# EAGLE board main (EAGLE 6.1), part 1 of 2
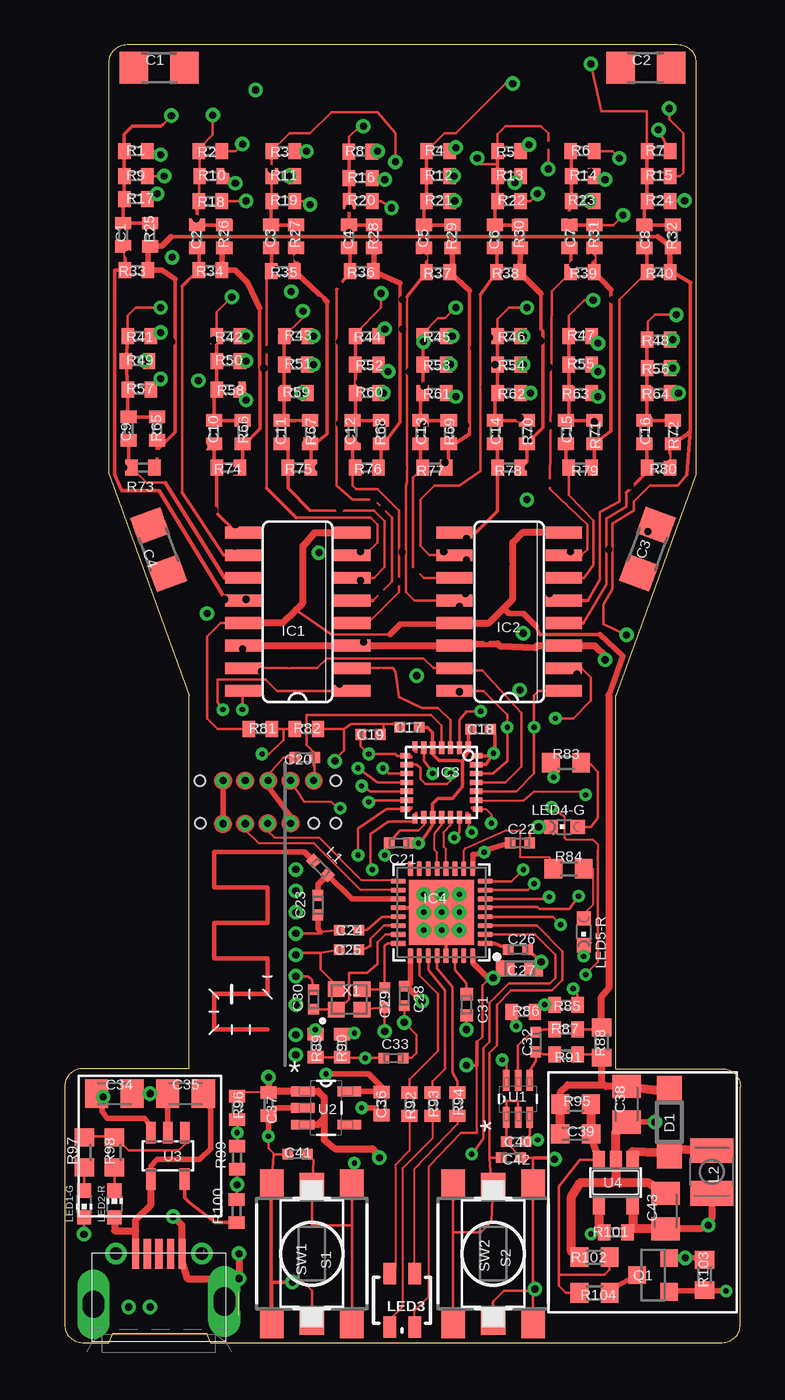
[diagram p2: board, top side]
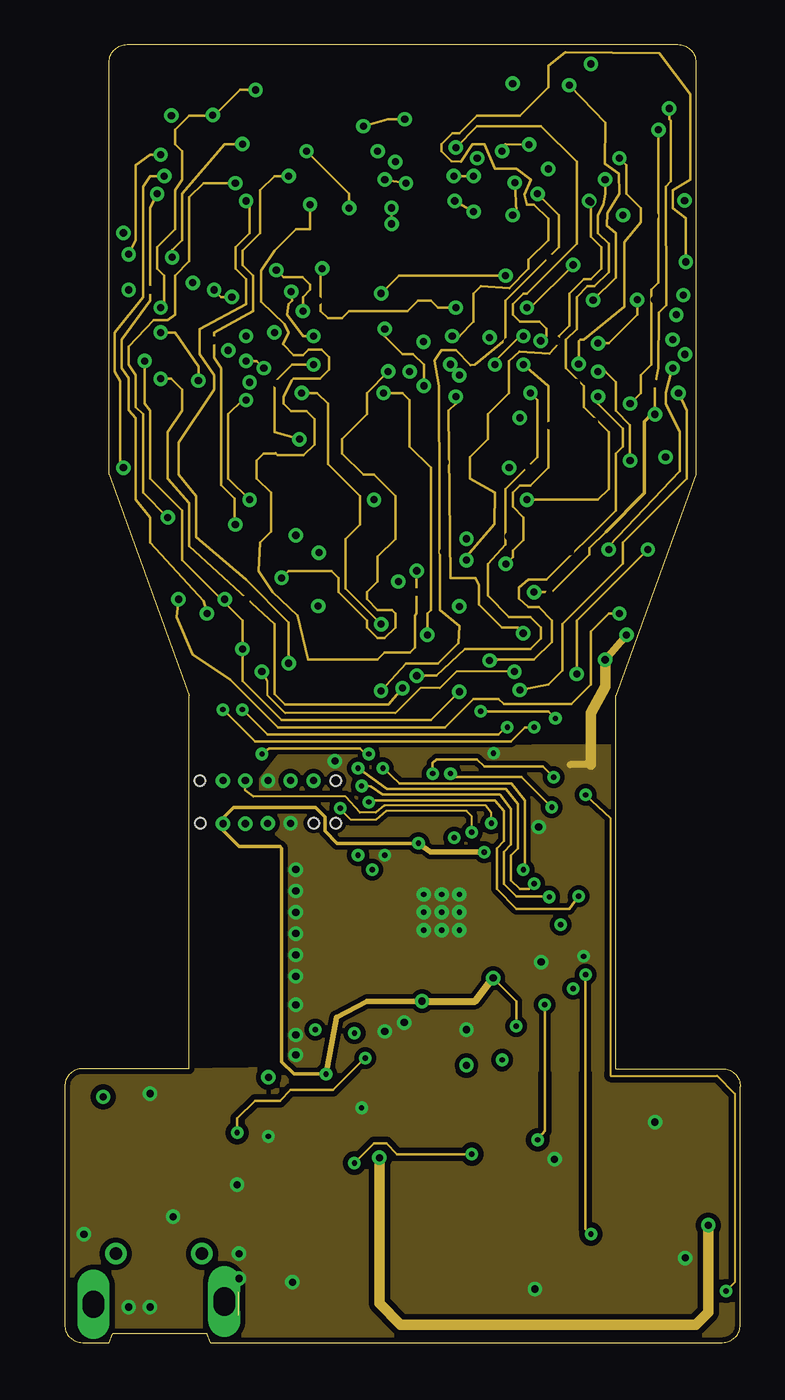
[diagram p3: board, inner layer Route2]
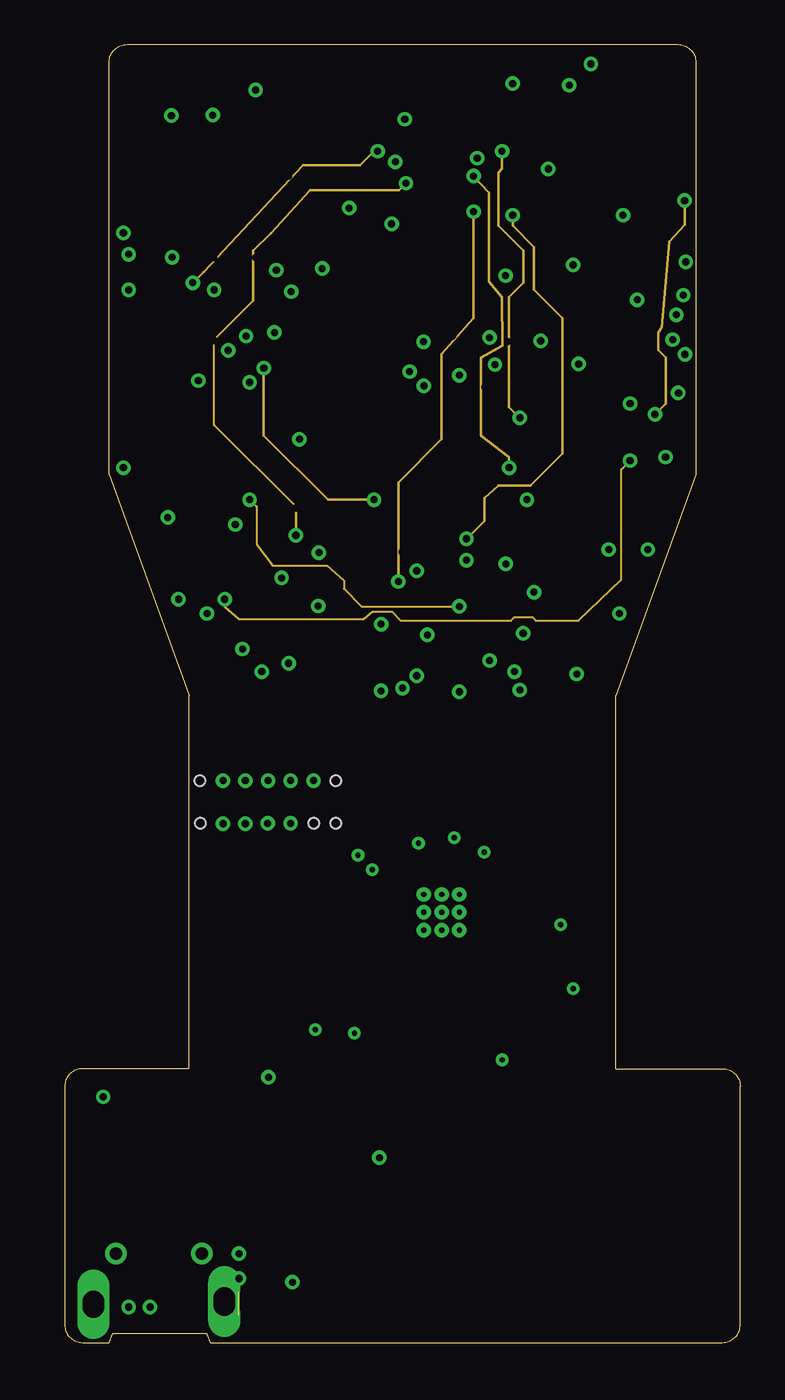
[diagram p4: board, inner layer Route3]
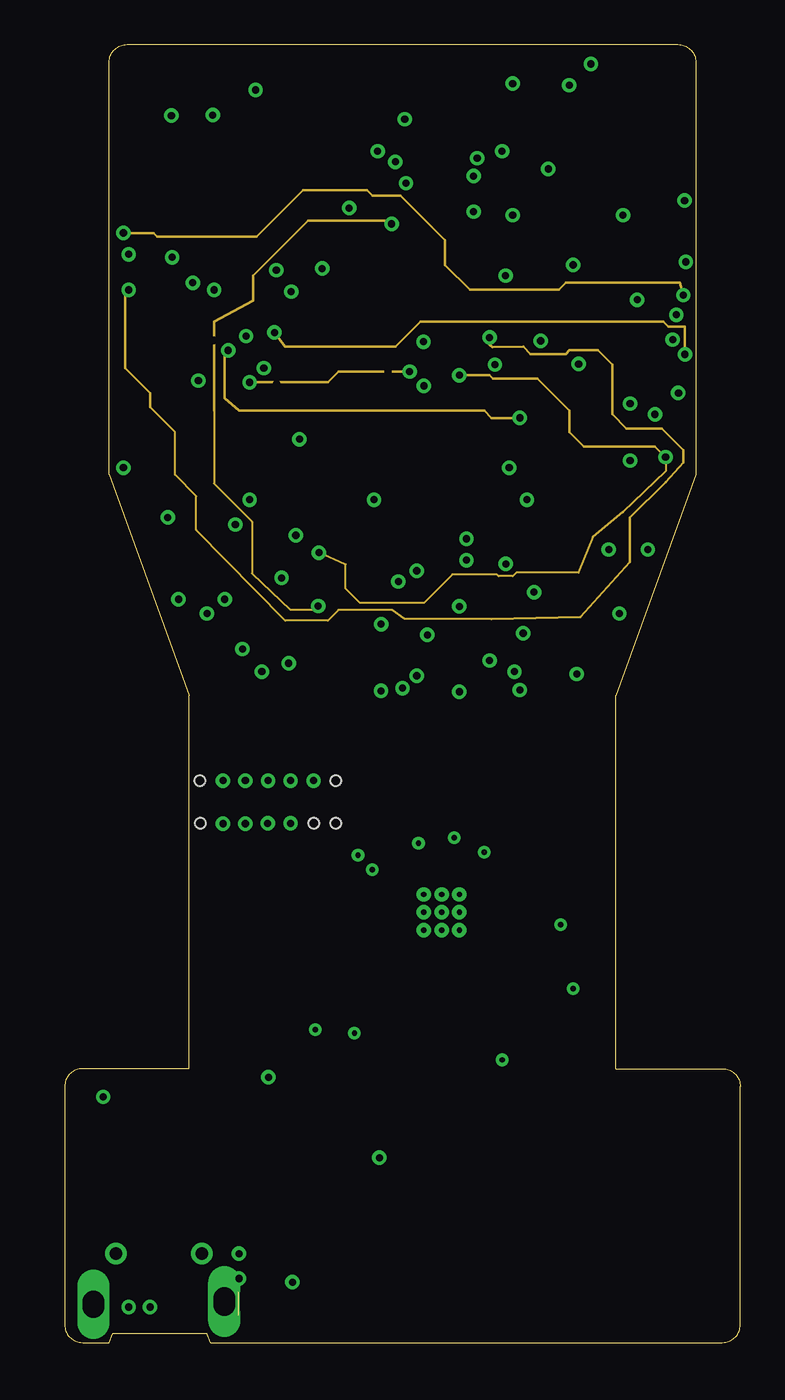
[diagram p5: board, inner layer Route4]
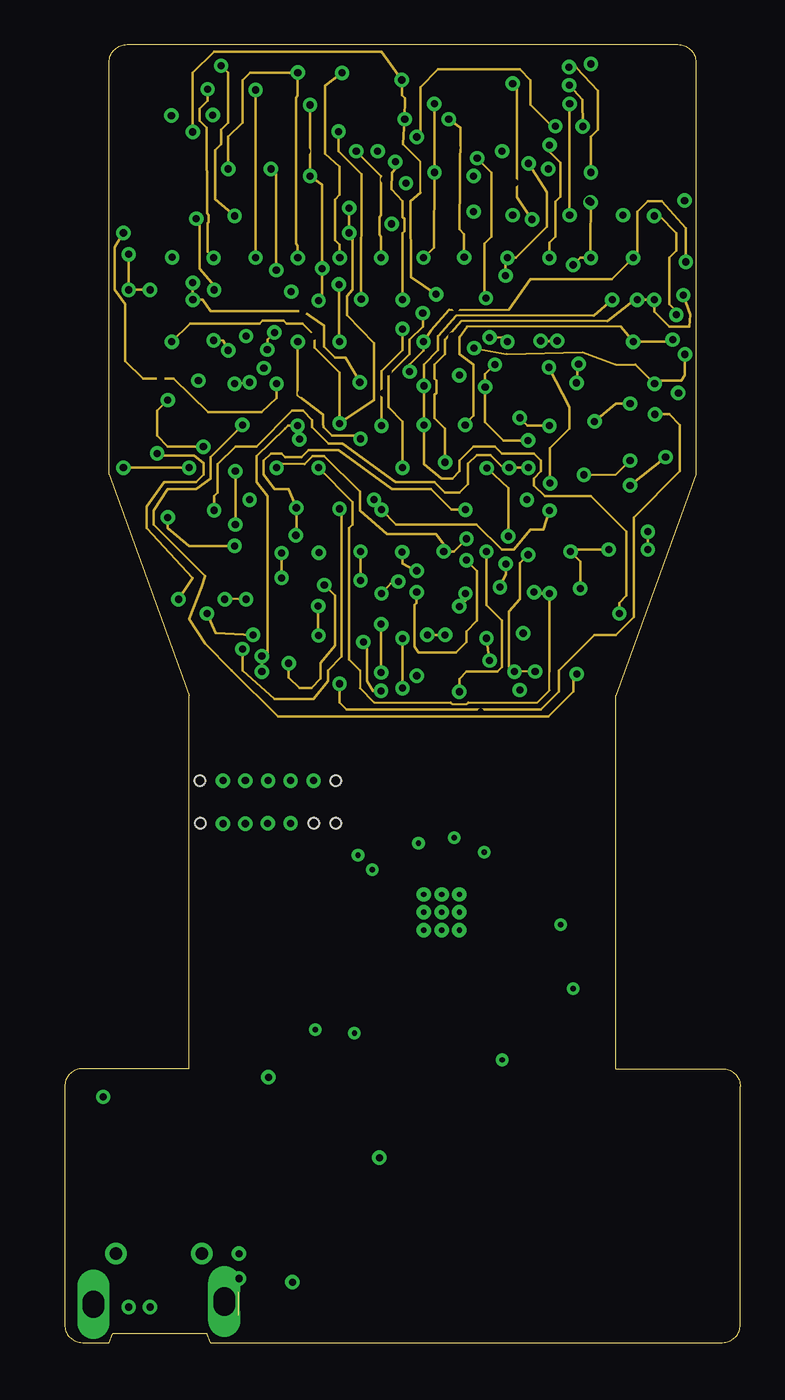
[diagram p6: board, inner layer Route15]
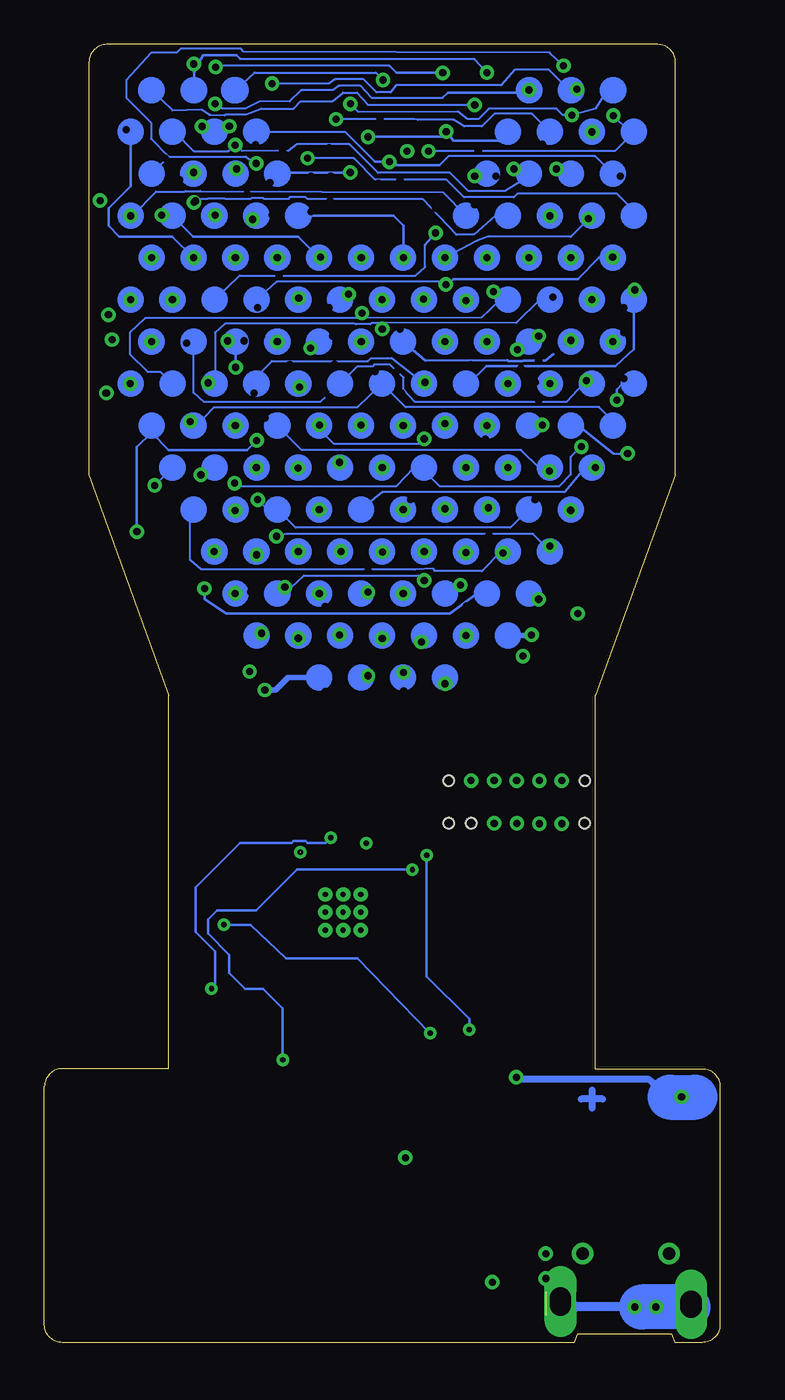
[diagram p7: board, bottom side, seen from below]

Size 38 x 73 mm. Coordinates in mm from the lower left corner, seen from the top.
Outline: 2.5,48.8 2.5,72 arc-90 3.5,73 34.5,73 arc-90 35.5,72 35.5,48.8 31,36.4 31,15.4 37,15.4 arc-90 38,14.4 38,1 arc-90 37,0 8.2,0 8,0.5 2.7,0.5 2.5,0 1,0 arc-90 0,1 0,14.4 arc-90 1,15.4 7,15.4 7,36.4 2.5,48.8
Copper layers [2:(1*(2*(3*4)*15)*16):15]: Top 0.018mm / dielectric 0.15mm / Route2 0.018mm / dielectric 0.15mm / Route3 0.018mm / dielectric 0.15mm / Route4 0.018mm / dielectric 0.15mm / Route15 0.018mm / dielectric 0.15mm / Bottom 0.018mm
Design rules: minimum track width 0.125mm, minimum drill 0.4mm, track to track 0.15mm, track to pad 0.15mm, pad to pad 0.15mm, via to via 0.15mm, smd to smd 0mil, copper to edge 0.2mm, drill to drill 0.2mm, minimum pad ring 10mil, minimum via ring 8mil, stop-mask expansion 4mil, vias tented up to drill 0.5mm, thermal gap 10mil
Holes 0.6 mm at 14,29.2 7.62,29.2 7.6,31.6 15.26,31.6 15.26,29.2

## Footprints (pad centres in the part's own frame; a part is rotated, then mirrored left to right if it is on the bottom)
C0402 = smd 0.7 x 0.9: 1 -0.65,0; 2 0.65,0
RESC0402_N = smd 0.6 x 0.6: 1 -0.55,0; 2 0.55,0
RESC0603_N = smd 1.05 x 0.9: 1 -0.8,0; 2 0.8,0
RESC0402_M = smd 0.7 x 0.7: 1 -0.6,0; 2 0.6,0
C0805K = smd 1.3 x 1.6: 1 -1,0; 2 1,0
C0603K = smd 1.05 x 1.08: 1 -0.875,0; 2 0.875,0
SOD123 = smd 1.4 x 1.4: A 1.9,0; C -1.9,0
SO16 = smd 0.66 x 2.032: 1 -4.445,-3.073; 2 -3.175,-3.073; 3 -1.905,-3.073; 4 -0.635,-3.073; 5 0.635,-3.073; 6 1.905,-3.073; 7 3.175,-3.073; 8 4.445,-3.073; 9 4.445,3.073; 10 3.175,3.073; 11 1.905,3.073; 12 0.635,3.073; 13 -0.635,3.073; 14 -1.905,3.073; 15 -3.175,3.073; 16 -4.445,3.073
UFQFPN28 = smd 0.5 x 0.3: 1 -2.055,1.5; 7 -2.055,-1.5; 15 2.055,-1.5; 21 2.055,1.5 | smd 0.7 x 0.3: 2 -1.955,1; 3 -1.955,0.5; 4 -1.955,0; 5 -1.955,-0.5; 6 -1.955,-1; 16 1.955,-1; 17 1.955,-0.5; 18 1.955,0; 19 1.955,0.5; 20 1.955,1 | smd 0.3 x 0.5: 8 -1.5,-2.055; 14 1.5,-2.055; 22 1.5,2.055; 28 -1.5,2.055 | smd 0.3 x 0.7: 9 -1,-1.955; 10 -0.5,-1.955; 11 0,-1.955; 12 0.5,-1.955; 13 1,-1.955; 23 1,1.955; 24 0.5,1.955; 25 0,1.955; 26 -0.5,1.955; 27 -1,1.955
QFN50P500X500X90-32_N = smd 0.85 x 0.3: P$1 -2.45,1.75; P$2 -2.45,1.25; P$3 -2.45,0.75; P$4 -2.45,0.25; P$5 -2.45,-0.25; P$6 -2.45,-0.75; P$7 -2.45,-1.25; P$8 -2.45,-1.75; P$17 2.45,-1.75; P$18 2.45,-1.25; P$19 2.45,-0.75; P$20 2.45,-0.25; P$21 2.45,0.25; P$22 2.45,0.75; P$23 2.45,1.25; P$24 2.45,1.75 | smd 0.3 x 0.85: P$9 -1.75,-2.45; P$10 -1.25,-2.45; P$11 -0.75,-2.45; P$12 -0.25,-2.45; P$13 0.25,-2.45; P$14 0.75,-2.45; P$15 1.25,-2.45; P$16 1.75,-2.45; P$25 1.75,2.45; P$26 1.25,2.45; P$27 0.75,2.45; P$28 0.25,2.45; P$29 -0.25,2.45; P$30 -0.75,2.45; P$31 -1.25,2.45; P$32 -1.75,2.45 | smd 3.65 x 3.65: P$33 0,0 | drill 0.3 pad 0.6: P$34 -1,1; P$35 0,1; P$36 1,1; P$37 -1,0; P$38 0,0; P$39 1,0; P$40 -1,-1; P$41 0,-1; P$42 1,-1
L2825P = smd 1.4 x 2.4: 1 -1.2,0; 2 1.2,0
CHIP-LED0603 = smd 0.8 x 0.8: A 0,-0.75; C 0,0.75
LED-TRICOLOR-SMD = smd 1.2 x 0.7: A 1.5,0.7; B -1.5,0.7; G -1.5,-0.7; R 1.5,-0.7
CHIPLED_0603 = smd 0.8 x 0.8: A 0,-0.75; C 0,0.75
SOT23 = smd 1 x 1: 1 -0.95,-0.9; 2 0.95,-0.9; 3 0,0.9
R0402 = smd 0.7 x 0.9: 1 -0.65,0; 2 0.65,0
R0603 = smd 1 x 1.1: 1 -0.85,0; 2 0.85,0
DTSM-6 = smd 1.55 x 1.3: 1 -3.975,2.25; 2 3.975,2.25; 3 -3.975,-2.25; 4 3.975,-2.25
KSS-2EG4430 = smd 1.6 x 1.4: 1 -3.75,0; 2 3.75,0
SOT65P210X110-6N = smd 1.168 x 0.356: 1 -1.041,0.66; 2 -1.041,0; 3 -1.041,-0.66; 4 1.041,-0.66; 5 1.041,0; 6 1.041,0.66
SOT95P280X110-5N = smd 1.321 x 0.559: 1 -1.295,0.94; 2 -1.295,0; 3 -1.295,-0.94; 4 1.295,-0.94; 5 1.295,0.94
SOT23-5L = smd 0.533 x 1.2: 1 -0.95,-1.3; 2 0,-1.3; 3 0.95,-1.3 | smd 0.55 x 1.2: 4 0.95,1.3; 5 -0.95,1.3
SOT23-5 = smd 0.69 x 0.99: 1 -0.95,-1.29; 2 0,-1.29; 3 0.95,-1.29; 4 0.95,1.3; 5 -0.95,1.3
47589-0001 = smd 1.7 x 0.4: 1 2.8,1.3; 2 2.8,0.65; 3 2.8,0; 4 2.8,-0.65; 5 2.8,-1.3 | drill 1.2 pad 1.6 long: CASING1 -0.1,3.675; CASING2 0.1,-3.675; CASING5 -0.2,3.675; CASING6 -0.1,-3.675; CASING7 0.1,3.675; CASING8 0.3,-3.675 | drill 0.7 pad 1: CASING3 2.8,2.425; CASING4 2.8,-2.425
QWMP_MEANDERED_LEFT_+6 = smd 0.254 x 0.254: P$1 0,0
BT-XTAL_2016_N = smd 0.95 x 0.85: 1 -0.725,-0.575; 2 0.725,-0.575; 3 0.725,0.575; 4 -0.725,0.575
R1206 = smd 1.6 x 1.803: 1 -1.422,0; 2 1.422,0

## Placement (x,y rotation side)
C1  1uF  [C0402]  3.3,62.3 90 top
C2  1uF  [C0402]  7.44,62.2 90 top
C3  1uF  [C0402]  11.6,62.2 90 top
C4  1uF  [C0402]  16,62.2 90 top
C5  1uF  [C0402]  20.2,62.2 90 top
C6  1uF  [C0402]  24.2,62.2 90 top
C7  1uF  [C0402]  28.4,62.2 90 top
C8  1uF  [C0402]  32.6,62.2 90 top
C9  1uF  [C0402]  3.6,51.4 90 top
C10  1uF  [C0402]  8.4,51.2 90 top
C11  1uF  [C0402]  12.2,51.2 90 top
C12  1uF  [C0402]  16.2,51.2 90 top
C13  1uF  [C0402]  20,51.2 90 top
C14  1uF  [C0402]  24.2,51.2 90 top
C15  1uF  [C0402]  28.2,51.2 90 top
C16  1uF  [C0402]  32.6,51.2 90 top
C17  100nF  [RESC0402_N]  19.4,34.6 180 top
C18  100nF  [RESC0402_N]  23.4,34.5 0 top
C19  100nF  [RESC0402_N]  17.2,34.2 0 top
C20  100nF  [RESC0402_N]  13.5,32.9 180 top
C21  100nF  [RESC0402_N]  18.8,28.1 180 top
C22  100nF  [RESC0402_N]  25.6,28.1 0 top
C23  0.8pF  [RESC0402_N]  14.24,24.6 270 top
C24  N.M.  [RESC0402_N]  16,23.2 180 top
C25  220pF  [RESC0402_N]  16,22.1 180 top
C26  100nF  [RESC0402_N]  25.5,22.1 0 top
C27  1µF  [RESC0603_N]  25.58,21.04 0 top
C28  100nF  [RESC0402_N]  19.1,19.5 270 top
C29  12pF  [RESC0402_N]  18,19.4 270 top
C30  12pF  [RESC0402_N]  14,19.3 90 top
C31  1.0µF  [RESC0402_M]  22.6,19 270 top
C32  100nF  [RESC0402_N]  26.5,16.9 90 top
C33  100nf  [RESC0402_N]  18.5,16 0 top
C34  4.7uF  [C0805K]  2.8,14 0 top
C35  4.7uF  [C0805K]  6.8,14 180 top
C36  0.1uF  [C0402]  17.83,13.44 270 top
C37  0.1uF  [C0402]  11.47,13.42 270 top
C38  4.7uF  [C0805K]  31.6,13.4 90 top
C39  220pf  [C0603K]  28.74,11.74 0 top
C40  100nF  [RESC0402_N]  25.4,11.3 0 top
C41  100nF  [RESC0402_N]  13.1,10.6 180 top
C42  100nF  [RESC0402_N]  25.1,10.4 0 top
C43  2.2uF  [C0805K]  33.8,7.4 90 top
D1  MBR0530  [SOD123]  34,12.4 270 top
IC1  DG408DY  [SO16]  13.1,41.1 90 top
IC2  DG408DY  [SO16]  25,41.1 90 top
IC3  STM32L031G4U  [UFQFPN28]  21.2,31.5 270 top
IC4  NRF52810_QC  [QFN50P500X500X90-32_N]  21.2,24.2 180 top
L1  3.9nH  [RESC0402_N]  14.4,26.7 135 top
L2  10uH LQH32MN100J23L  [L2825P]  36.4,9.6 90 top
LED1-G  [CHIP-LED0603]  1.1,7.8 180 top
LED2-R  [CHIP-LED0603]  2.8,7.8 0 top
LED3  TO-3228BC-MRPBGHF  [LED-TRICOLOR-SMD]  18.98,2.38 270 top
LED4-G  [CHIPLED_0603]  28.1,29 90 top
LED5-R  [CHIPLED_0603]  29.2,23.1 180 top
Q1  irlml2502  [SOT23]  33.1,3.8 90 top
R1  330  [R0402]  4,67 0 top
R2  330  [R0402]  8.2,67 0 top
R3  330  [R0402]  12.3,67 0 top
R4  330  [R0402]  21,67 0 top
R5  330  [R0402]  25,67 0 top
R6  330  [R0402]  29.12,67 0 top
R7  330  [R0402]  33.4,67 0 top
R8  330  [R0402]  16.62,66.96 0 top
R9  1K  [R0402]  4,65.6 0 top
R10  1K  [R0402]  8.24,65.6 0 top
R11  1K  [R0402]  12.3,65.6 0 top
R12  1K  [R0402]  21,65.6 0 top
R13  1K  [R0402]  25,65.6 0 top
R14  1K  [R0402]  29.14,65.6 0 top
R15  1K  [R0402]  33.4,65.6 0 top
R16  1K  [R0402]  16.64,65.48 0 top
R17  3.3K  [R0402]  4,64.3 0 top
R18  3.3K  [R0402]  8.2,64.2 0 top
R19  3.3K  [R0402]  12.3,64.2 0 top
R20  3.3K  [R0402]  16.66,64.2 0 top
R21  3.3K  [R0402]  21,64.2 0 top
R22  3.3K  [R0402]  25,64.2 0 top
R23  3.3K  [R0402]  29.14,64.2 0 top
R24  3.3K  [R0402]  33.4,64.2 0 top
R25  100K  [R0402]  4.8,62.3 90 top
R26  100K  [R0402]  8.98,62.2 90 top
R27  100K  [R0402]  13,62.2 90 top
R28  100K  [R0402]  17.4,62.2 90 top
R29  100K  [R0402]  21.8,62.2 90 top
R30  100K  [R0402]  25.6,62.2 90 top
R31  100K  [R0402]  29.8,62.2 90 top
R32  100K  [R0402]  34.2,62.2 90 top
R33  1K  [R0402]  4.04,60.32 180 top
R34  1K  [R0402]  8.2,60.32 180 top
R35  1K  [R0402]  12.28,60.26 180 top
R36  1K  [R0402]  16.7,60.26 180 top
R37  1K  [R0402]  21,60.2 180 top
R38  1K  [R0402]  24.94,60.2 180 top
R39  1K  [R0402]  29.12,60.2 180 top
R40  1K  [R0402]  33.4,60.2 180 top
R41  330  [R0402]  4.2,56.6 0 top
R42  330  [R0402]  9.2,56.6 0 top
R43  330  [R0402]  13,56.6 0 top
R44  330  [R0402]  17,56.6 0 top
R45  330  [R0402]  20.8,56.6 0 top
R46  330  [R0402]  25,56.6 0 top
R47  330  [R0402]  29,56.6 0 top
R48  330  [R0402]  33.4,56.4 0 top
R49  1K  [R0402]  4.1,55.2 0 top
R50  1K  [R0402]  9.2,55.2 0 top
R51  1K  [R0402]  13,55 0 top
R52  1K  [R0402]  17,55 0 top
R53  1K  [R0402]  20.8,55 0 top
R54  1K  [R0402]  25,55 0 top
R55  1K  [R0402]  29,55 0 top
R56  1K  [R0402]  33.4,54.8 0 top
R57  3.3K  [R0402]  4.2,53.6 0 top
R58  3.3K  [R0402]  9.2,53.6 0 top
R59  3.3K  [R0402]  13,53.4 0 top
R60  3.3K  [R0402]  17,53.4 0 top
R61  3.3K  [R0402]  20.8,53.4 0 top
R62  3.3K  [R0402]  25,53.4 0 top
R63  3.3K  [R0402]  29,53.4 0 top
R64  3.3K  [R0402]  33.4,53.4 0 top
R65  100K  [R0402]  5.2,51.4 90 top
R66  100K  [R0402]  10,51.2 90 top
R67  100K  [R0402]  13.8,51.2 90 top
R68  100K  [R0402]  17.8,51.2 90 top
R69  100K  [R0402]  21.6,51.2 90 top
R70  100K  [R0402]  26,51.2 90 top
R71  100K  [R0402]  29.8,51.2 90 top
R72  100K  [R0402]  34.2,51.2 90 top
R73  1K  [R0402]  4.4,49.2 180 top
R74  1K  [R0402]  9.2,49.2 180 top
R75  1K  [R0402]  13.2,49.2 180 top
R76  1K  [R0402]  17,49.2 180 top
R77  1K  [R0402]  20.8,49.2 180 top
R78  1K  [R0402]  25,49.2 180 top
R79  1K  [R0402]  29,49.2 180 top
R80  1K  [R0402]  33.4,49.2 180 top
R81  390K  [R0402]  11,34.5 0 top
R82  68K  [R0402]  13.6,34.5 0 top
R83  1K  [R0603]  28.2,32.6 180 top
R84  1K  [R0603]  28.34,26.64 180 top
R85  1  [R0402]  28.2,19 180 top
R86  N.C.  [R0402]  25.8,18.6 0 top
R87  1  [R0402]  28.2,17.6 0 top
R88  0,5  [R0603]  30.2,16.88 90 top
R89  N.C.  [R0402]  14.1,16.7 270 top
R90  0  [R0402]  15.6,16.7 270 top
R91  1  [R0402]  28.2,16.2 0 top
R92  1K  [R0402]  19.4,13.4 90 top
R93  1K  [R0402]  20.7,13.4 90 top
R94  1K  [R0402]  22.1,13.4 90 top
R95  180 K  [R0603]  28.74,13.4 0 top
R96  100K  [R0402]  9.7,13.2 270 top
R97  1K  [R0603]  1.1,10.7 90 top
R98  1K  [R0603]  2.8,10.7 90 top
R99  330K  [R0402]  9.7,10.4 270 top
R100  10K  [R0402]  9.66,7.4 90 top
R101  100K  [R0402]  31,6.2 180 top
R102  15 K  [R0603]  29.8,4.8 180 top
R103  100K  [R0603]  36,3.8 90 top
R104  47K  [R0603]  29.8,2.8 0 top
S1  DTSM-6  [DTSM-6]  13.9,5 270 top
S2  DTSM-6  [DTSM-6]  24.1,5 90 top
SW1  KSS-2EG4430  [KSS-2EG4430]  13.9,5 90 top
SW2  KSS-2EG4430  [KSS-2EG4430]  24.1,5 90 top
U1  INA199A1DCKR  [SOT65P210X110-6N]  25.5,13.7 90 top
U2  TLV70033DDCR  [SOT95P280X110-5N]  14.7,13.2 0 top
U3  MCP73831T-2ATI/OT  [SOT23-5L]  5.8,10.5 180 top
U4  LM2703MF-ADJ/NOPB  [SOT23-5]  31,9 180 top
U5  MICRO-USB  [47589-0001]  5.3,2.2 90 top
U$1  ANTENNA_QUARTER-WAVE_MONOPOLE_MEANDERED_LEFT  [QWMP_MEANDERED_LEFT_+6]  12.4,27.6 180 top
X1  NX2016SA-32Mhz  [BT-XTAL_2016_N]  16,19.3 0 top
С1  4,7uf size - 1210  [R1206]  5.32,71.7 0 top
С2  4,7uf size - 1210  [R1206]  32.68,71.7 0 top
С3  4,7uf size - 1210  [R1206]  32.78,44.62 70 top
С4  4,7uf size - 1210  [R1206]  5.28,44.6 110 top

## Tracks (layer width: path | path; a pad name or v marks a point on that pad's centre or on a via)
18V_OUT
  Top 0.15: 18.3,39.82 15,39.82 13,41.2 | 21.86,40.4 IC2.13 | 24.8,41.2 24.8,41.4 | R81.1 8.6,34.5 8,35.1 8,39.7 8.77,40.46 IC1.13 | R87.2 30.13,17.6 R88.2
  Top 0.2: 30.1,39.82 26.7,39.82 26.5,40.3
  Top 0.3: 18.3,39.82 18.9,40.4 21.86,40.4 | 30.6,36.4 31.4,38.6 30.1,39.82 | 26.5,40.3 25.8,41 25,41 24.8,41.2
  Top 0.4: 27.73,45.6 IC2.8 25.74,45.55 25.2,45 25.2,41.8 24.8,41.4 23.87,40.46 IC2.13 | 30.6,36.4 30.6,19.95 30.2,19.45 R88.2 | IC1.13 12.26,40.46 13,41.2 13.4,41.6 13.4,44.8 14.04,45.55 IC1.8
+3V3  (via drill 0.3 pad 0.7, 0.3 pad 0.7 layers 1-2, 0.4 pad 0.7, 0.4 pad 0.7 layers 1-2)  (1 unrouted)
  Top 0.125: LED3.A 19.68,1.78 20.5,2.6 20.5,9.9 22.3,11.8 | 23.2,12 23.2,16.9
  Top 0.15: C18.1 22.7,34.35 | C21.1 20,28.1 | 23.2,12 23.2,11.8 22.3,11.8 | 23.85,20.45 23.5,20.1 23.5,17.2 23.2,16.9 | R86.1 25.15,18.05 v25.4,17.8
  Top 0.17: 22.7,33.22 22.38,32.7
  Top 0.2: C28.1 19.35,19.95 | 23.7,27.7 23.5,27.5 | 22.7,33.22 IC3.1 22.7,34.35 | C17.1 20.4,34.6 20.7,34.3 IC3.5 20.7,33.1 21.06,32.74 22.1,32.74 22.38,32.7 22.38,31.28 21.8,30.6 21,30.6 20.7,30.3 IC3.17 20.7,29.1 20,28.1 | v19.9,28.08 19.28,28.1 C21.1 | 23.2,16.9 23.2,15.6 v22.6,15.6
  Top 0.3: IC4.P$32 22.95,21.35 23.85,20.45 24.16,20.54 | IC4.P$25 19.45,20.2 C28.1 | 19.35,19.95 v20.1,19.2 | 22.95,26.9 IC4.P$9 22.95,27.45 23.5,27.5 | v24.1,20.5 24.18,20.48 C27.1 | C36.1 17.78,14.14 U2.5 18.06,14.14 17.1,15.1 v14.7,15.1 | C22.1 23.7,27.7 v23.6,27.58 | v8.9,31.6 v8.9,29.18
  Top 0.4: C27.1 24.16,20.54
  Top 1: v8.9,29.18 8.9,29.16 | v8.9,31.6 8.92,31.6
  Route2 0.15: v25.4,17.8 25.4,19.2 v24.1,20.5
  Route2 0.2: v14.7,15.1 12.9,15.1 12.2,15.8 12.2,27.8 12.1,27.9 9.8,27.9 8.9,28.8 v8.9,29.18 8.9,29.5 9.5,30.1 14.1,30.1 14.64,29.56 14.64,28.76 15.32,28.08 v19.9,28.08
  Route2 0.3: v14.7,15.1 15.3,18.3 17,19.2 v20.1,19.2 | 23.62,27.58 20.7,27.6 20.58,27.6 v19.9,28.08
  Route2 0.4: v20.1,19.2 23.1,19.2 v24.1,20.5
+4.1V  (via drill 0.4 pad 0.7, 0.4 pad 0.7 layers 1-2)
  Top 0.125: C37.1 9.83,14.08 R96.1
  Top 0.15: C34.1 2.4,13.72 v2.16,13.82
  Top 0.3: 11.54,14.14 C37.1 | U3.3 4.84,12.16 4.5,12.6 2.4,12.6 2.1,13 2.1,13.76 v2.16,13.82
  Top 0.4: 31.95,6.5 31.85,6.4 | L2.1 36.4,7 | 36.4,7 35.8,6.4 C43.1 | 11.54,14.14 U2.1 14.26,14.14 14.6,13.8 14.6,12.6 | 14.6,12.6 14.26,12.26 U2.3 | v11.46,14.92 C37.1 | v36.2,6.6 36.4,7 | 14.6,12.6 14.6,11.4 15.2,10.9 17.3,10.9 v17.7,10.4
  Top 0.5: U4.5 31.95,6.5 | C43.1 31.85,6.4 R101.1
  Route2 0.6: v36.2,6.6 36.2,1.7 35.5,1 18.9,1 17.7,2.2 v17.7,10.4
  Bottom 0.15: 2.8,13.8 2.8,13.72 v2.16,13.82
  Bottom 0.4: 2.8,13.8 4,14.8 11.34,14.8 v11.46,14.92
  Bottom 2.54: 2.8,13.8 1.4,13.8
+5V
  Top 0.3: C35.1 7.8,13.6 8.2,13.2 8.2,10.9 7.6,10.3 5.2,10.3 4.85,9.95 U3.4
  Top 0.4: U5.1 4,6.3 | 4,6.3 4,6.9 4.85,7.75 U3.4 | LED2-R.A 2.8,6.3 4,6.3
+18V
  Top 0.15: R91.2 30.17,16.2 R88.1
  Top 0.4: C39.1 27.89,12.04 | 33.3,14.2 D1.C | C38.2 30.45,14.4 30.35,14.5 30.2,14.5 | R95.1 27.89,14.09 28.3,14.5 30.2,14.5 | R88.1 30.2,14.5
  Top 0.406: 33.2,14.2 D1.C
  Top 0.5: 27.89,12.04 R95.1 | C38.2 33.2,14.2
A0  (via drill 0.3 pad 0.7 layers 1-2)
  Top 0.15: IC2.1 26.66,36.65 26.4,36.4 v26.4,34.6 26.4,32 25.4,31 IC3.24 | IC1.1 11.95,36.65 11.3,37.3 8.6,37.3 8.6,36 v8.9,35.6
  Route2 0.15: v8.9,35.6 10.7,33.8 25.1,33.8 25.9,34.6 v26.4,34.6
A1  (via drill 0.3 pad 0.7 layers 1-2)
  Top 0.15: IC3.26 24.1,32 24.9,32.7 v24.9,34.6 24.9,35.3 23.55,36.65 IC2.16 | IC1.16 9.96,36.65 10,36.6 v10,35.6
  Route2 0.15: v10,35.6 11.4,34.2 24.4,34.2 24.8,34.6 v24.9,34.6
A2
  Top 0.15: IC1.15 14.21,37.92 14.76,38.48 20.18,38.48 20.73,37.92 IC2.15 22.05,37.8 23.5,37.8 25.7,35.4 25.7,32.4 24.8,31.5 IC3.25
ANT1
  Top 0.3: IC4.P$19 16.15,24.95 L1.1 14.24,25.76 C23.1
DEC1
  Top 0.2: IC4.P$1 24.2,22.45 C26.1
DEC2
  Top 0.15: C24.1 17,23.2 17.85,23.95 IC4.P$21
DEC3
  Top 0.15: C25.1 16.8,22.1 17.2,22.3 17.2,22.7 17.95,23.45 IC4.P$22
DEC4
  Top 0.15: IC4.P$30 21.95,20.95 22.6,20.2 C31.1
ENA
  Top 0.15: IC1.2 18.48,37.92 18.6,37.7 18.8,36.3 20.1,35.7 21,35.7 21.7,35 IC3.3
ENB  (via drill 0.3 pad 0.7 layers 1-2)
  Top 0.15: IC3.2 22.2,35 22.6,35.5 v23.4,35.5 | v27.6,35.1 28.6,35.1 29.6,36.1 29.6,37.4 29.07,37.92 IC2.2
  Route2 0.15: v23.4,35.5 27.2,35.5 v27.6,35.1
GND  (via drill 0.3 pad 0.7 layers 1-2, 0.4 pad 0.7, 0.4 pad 0.7 layers 1-2)
  Top 0.15: X1.2 16.75,18.75 C29.2 v18,17.5 | C31.2 v22.6,17.6 | C28.2 v19.1,18 19.8,17.3 19.8,16.3 19.5,16 C33.2 | 21.45,22.95 IC4.P$35 | 19.95,24.45 IC4.P$39 | C22.2 26.17,28.77 v26.66,29 26.9,29.05 LED4-G.C | C30.2 13.9,20.4 13.7,20.6 v13,20.6 | C24.2 14.4,23.1 14.3,23 v13,23 | 29.77,62.17 29.8,62.2 | 25.65,62.15 25.6,62.2 | 8.85,62.15 8.8,62.2 | 35,48.8 34.5,48.2 32.9,48.2 32,47.3 32,46.8 30.81,46.07 30.81,42.37 30.3,41.5 30.3,40.4 v31.6,39.8 | v9.7,8.88 9.69,8.66 R99.2 R100.2 | C25.2 14.4,21.9 | 14.4,21.9 13.1,21.9 v13,21.8 | X1.4 15.28,20.12 14.4,21 14.4,21.9 | 23.9,33 24.1,33.1 | C18.2 23.95,34.45 | 18.65,34.4 C17.2 18.85,34.8 17.92,34.8 | 15.7,34.5 R82.2 | v15.2,32.7 15.2,32.8 15.7,33.3 15.7,34.5 | C20.2 12.3,32.9 11.4,31.9 11.4,31.64 v11.44,31.6 11.44,31.26 | 11.47,11.87 11.47,10.93 11.8,10.6 | C41.2 11.8,10.6 | S1.3 11.75,10.55 11.8,10.6 | v12.81,3.4 13.4,3.4 13.9,2.9 SW1.1 | 26.35,3.21 S2.4 26.35,10.4 | SW2.1 24.1,2.3 24.7,2.9 26.45,2.9 v26.45,3.01 26.45,2.81 26.35,2.81 S2.3 | 26.35,10.4 C42.2 C40.1 24.85,12.57 U1.1 24.84,13.54 arc-90 24.9,13.6 25.5,13.6 U1.2 | R103.2 35.69,4.76 | IC3.16 20.2,29.1 19.9,28.8 18.85,28.8 C21.2 | LED5-R.C 29.2,21.74 v29.18,21.72 | C27.2 26.8,20.84 v26.8,21.4 | v27.55,10.31 27.6,10.31 27.6,10.3 | 26.4,10.4 26.35,10.4 | 15.7,34.5 16.1,34.8 17.92,34.8 | C19.2 17.92,34.2 17.92,34.8 | LED1-G.C 1.1,6.3 v1.08,6.1
  Top 0.2: C26.2 v26.8,21.4 | IC4.P$29 21.45,22.95 | IC4.P$20 19.95,24.45 | Q1.2 34.25,4.81 | R26.1 8.85,61.65 8.85,62.15 | R25.1 4.69,61.65 | R35.1 13,60.26 | R36.1 17.4,60.26 | R37.1 21.8,60.2 | R30.1 25.65,61.55 25.65,62.15 | R31.1 29.77,61.55 29.77,62.17 | R32.1 34.05,61.55 | R73.1 5.2,49.35 5.2,50.2 | 5.2,50.2 R65.1 | R74.1 10,49.35 10,50.4 | 10,50.4 R66.1 | R76.1 17.8,49.35 R68.1 17.95,50.55 18.85,51.76 18.85,59.57 | R77.1 21.6,49.35 R69.1 21.95,50.55 22.77,51.1 22.77,59.15 | 6,62.2 8.8,62.2 13,62.2 | 13,62.2 17.4,62.2 | 17.4,62.2 21.8,62.2 | 21.8,62.2 25.6,62.2 29.8,62.2 33.35,62.2 | R29.1 21.8,62.2 | R28.1 17.4,62.2 | R27.1 13,62.2 | 5.2,50.2 6.2,51.2 6.2,59.8 | 10,50.4 11,51.4 10.97,58.18 | R75.1 13.85,50.4 | 13.85,50.4 R67.1 | R78.1 26,49.55 R70.1 26.91,51.45 26.91,56.89 26.8,57 26.8,58.99 | R79.1 29.8,49.35 R71.1 30.73,51.26 30.73,59.2 | 29.8,60.2 R39.1 | R80.1 34.05,50.4 R72.1 35,51.05 35.2,51.3 | 35.2,51.3 35.2,59.6 | 34.2,60.2 R40.1 | 13.85,50.4 14.76,51.09 14.76,58.53 | 35.2,51.3 35,48.8 | IC3.28 23.9,33 24.2,33.32 24.2,34.2 23.95,34.45 | IC3.27 23.7,32.5 24.1,33.1 v24.12,33.14 | 12.7,29.6 v12.7,29.2 | v18,27.4 18.01,27.71 C21.2 | 26.4,10.4 27.4,10.4 27.6,10.3 | v12.81,3.4 11.65,3.4 S1.4
  Top 0.25: 35.2,59.6 34.2,60.2
  Top 0.3: C38.1 v33.2,12.4 | 34.25,4.81 v34.9,4.76 35.69,4.76 | C34.2 v4.8,14 C35.2 U3.2 | U2.2 11.9,13.2 C37.2 11.47,11.87 v11.46,11.6 | C36.2 17.42,13.2 v16.7,13.2 | C23.2 14.24,23.26 14.4,23.1 | 8.85,61.65 R34.1 9.58,60.32 10.3,59.6 10.97,58.18 | 4.69,61.65 R33.1 5.48,60.32 6.2,59.8 | 13,60.26 R27.1 | 17.4,60.26 R28.1 | 21.8,60.2 R29.1 | 25.65,61.55 R38.1 26.8,58.99 | 29.77,61.55 R39.1 | 34.05,61.55 R40.1 | R25.1 5.45,61.65 6,62.2 | 33.35,62.2 R32.1 | 18.85,59.57 R36.1 | 22.77,59.15 R37.1 | 30.73,59.2 29.8,60.2 | 14.76,58.53 R35.1 | 11.44,31.26 12.7,29.6 | U5.5 6.6,4.5
  Top 0.4: 31,11.8 C38.1 | IC1.14 IC1.3 IC2.14 23,39.2 23,39.3 24.35,39.29 24.47,39.18 26.48,39.08 26.6,39.2 IC2.3 29.8,39.2 30.4,38.6 v30.4,38.4 | v9.8,5 v9.8,3.6 6.9,3.6 6.6,4.5
  Top 0.5: 31,11.8 U4.2 31,9.2 | 31,9.2 31.2,9 32.8,9 C43.2 | R102.2 28.51,5.12 28.51,8.2 29.01,9 30.8,9 31,9.2
  Top 1: v12.7,29.2 12.72,29.2 | v11.44,31.6 11.46,31.6
  Route2 0.4: v30.4,38.4 v31.6,39.8 | 29.6,32.5 28.44,32.5
  Route2 0.6: v30.4,38.4 30.4,36.9 29.6,35.4 29.6,32.5
  Bottom 0.5: 4.4,2 8.1,2 v9.8,3.6
  Bottom 2.54: 1.8,2 4.4,2
  other vias: 13,26.6 13,25.4 13,24.2 13,17.3 13,19 13,16.18 6.1,7.08 3.6,2 4.8,2
  pour Route2 (isolate 0.254): 30.9,33.6 arc1 30.9,15.3 12.6,15.2 12.6,28 11,29.3 11,31.7 12.4,33.5
  pour Route2 (isolate 0.3): 0.2,0.2 0.2,15.2 28.6,15.6 37.8,15.2 37.8,0.4
M1.1
  Top 0.15: 17.06,40.46 18.8,42.2 18.8,46.8 17.6,48 16.4,48 16.2,48.2 16.2,49.05
  Top 0.2: C12.1 16.2,49.35 R76.2 16.2,49.05 | IC1.4 17.06,40.46
M1.2
  Top 0.15: 17.34,41.73 18.4,42.8 18.4,46.4 17.4,47.4 16.2,47.4 15.3,48.2 15.3,59.2
  Top 0.2: C4.1 16.05,61.55 R36.2 15.3,59.2 | IC1.5 17.34,41.73
M1.3
  Top 0.15: 13.8,46.8 17.4,46.8 18,46.2 18,43.6 17.41,43 IC1.6
  Top 0.2: C11.1 12.55,50.4 R75.2 12.55,48.05 13.8,46.8
M1.4
  Top 0.15: 11.36,59.99 11.36,48.06 | 13.02,46.4 17.2,46.4 17.6,46 17.6,45 16.88,44.27
  Top 0.2: C3.1 11.63,61.52 R35.2 11.36,59.99 | 11.36,48.06 13.02,46.4 | IC1.7 16.88,44.27
M1.5
  Top 0.2: C1.1 3.39,61.65 R33.2 2.81,60.32 2.8,59.8 2.8,48.8 3.2,47.9 5.3,47.9 9.06,41.73 IC1.12
M1.6
  Top 0.15: 5.65,48.35 4.6,48.35 R73.2
  Top 0.2: R73.2 3.6,49.35 C9.1 | 5.65,48.35 9,43 IC1.11
M1.7
  Top 0.15: 6.6,59.4 6.6,47.8
  Top 0.2: C2.1 7.55,61.65 R34.2 7.52,60.32 6.6,59.4 | 6.6,47.8 8.93,44.27 IC1.10
M1.8
  Top 0.2: C10.1 8.4,49.35 R74.2 8.55,46.65 9.66,45.55 IC1.9
M2.1
  Top 0.15: 31.6,47.8 31.6,47 30.47,46.33 30.47,42.63 29.16,40.46
  Top 0.2: C16.1 32.75,50.4 R80.2 32.75,48.95 31.6,47.8 | IC2.4 29.16,40.46
M2.2
  Top 0.15: 29.43,41.73 30.1,42.9 30.1,46.7 31.2,47.3 31.2,58.65 R40.2
  Top 0.2: C8.1 32.75,61.55 R40.2 | IC2.5 29.43,41.73
M2.3
  Top 0.15: IC2.6 29.2,43 29.73,43.72 29.73,46.22 28.35,47.65 R79.2
  Top 0.2: C15.1 28.2,49.35 R79.2
M2.4
  Top 0.15: 29.07,44.27 29.4,44.6 29.4,46 27.3,48 27.4,59.13 R39.2
  Top 0.2: C7.1 28.47,61.55 R39.2 | IC2.7 29.07,44.27
M2.5
  Top 0.15: IC2.12 19.66,41.73 19.2,42.2 19.2,48.2 19.26,48.38 19.26,58.83
  Top 0.2: C5.1 20.35,61.55 R37.2 19.26,58.83
M2.6
  Top 0.15: IC2.11 20.2,43 19.6,43.6 19.6,48.65 R77.2
  Top 0.2: C13.1 20,49.35 R77.2
M2.7
  Top 0.15: IC2.10 20.52,44.27 20,44.8 20,47.4 20.8,48.2 22.2,48.2 23.38,49.01 23.38,58.92
  Top 0.2: C6.1 24.35,61.55 R38.2 23.38,58.92
M2.8
  Top 0.2: C14.1 24.35,50.4 R78.2 24.35,46.75 23.15,45.55 IC2.9
N$1
  Top 0.125: R84.1 29.7,26.65 29.7,24.6 29.2,24.1 LED5-R.A
N$2
  Top 0.4: 6.6,5.6 6.6,6.6 6.1,7.1
N$3
  Top 0.15: IC4.P$24 18.15,22.45 18,22.3 C29.1 17.92,19.88 X1.3
N$4
  Top 0.125: R93.1 20.7,11.5 19,9.8 19,2 18.28,1.28 LED3.R
N$5
  Top 0.15: U4.3 28.99,10.29 27.8,8.8 27.81,3.8 | R102.1 30.65,4.1 30.35,3.8 27.81,3.8 | R104.1 28.2,2.8 27.8,3.2 27.81,3.8
  Top 0.4: U4.3 29.6,11.69 R95.2 | 29.59,11.86 C39.2
  Top 0.5: R95.2 29.59,11.86
N$6
  Top 0.15: U1.5 25.5,16.7 26.25,17.45 C32.2 26.95,17.6 R87.1
N$8
  Bottom 0.4: 7.2,14.2 7.2,13.2
N$9
  Top 0.15: R83.1 29.6,32.5 30,32.1 30,29.5 29.6,29 LED4-G.A
N$10
  Bottom 0.4: 6.6,13.7 7.8,13.7
N$11
  Top 0.15: U1.4 26.16,15.31 26.5,15.85 C32.1 26.95,16.2 R91.1
N$12
  Top 0.5: U4.1 31.95,10.75 33.4,10.7 34.1,10.7 | 34.1,10.7 34.3,10.9 L2.2 | D1.A 34.1,10.7
N$13  (via drill 0.3 pad 0.7 layers 1-2)
  Top 0.15: R99.1 v9.7,11.8 R96.2 | R89.2 R90.2 15.65,16 v16.9,16 C33.1
  Route2 0.15: v9.7,11.8 9.7,12.6 10.7,13.6 12.1,13.6 12.7,14.2 15.1,14.2 v16.9,16
N$14
  Top 0.125: R92.1 19.4,10.8 18.6,10 18.6,4.2 LED3.G
N$15
  Top 0.15: R97.1 LED1-G.A
N$16
  Top 0.15: 31.1,3.2 30.8,2.9 R104.2
  Top 0.3: Q1.3 31.1,3.2
N$17
  Top 0.125: R94.1 22.1,12.3 19.68,9.78 LED3.B
N$18  (via drill 0.3 pad 0.7 layers 1-2)
  Top 0.15: R85.2 v27,19 26.6,18.6 R86.2 | v26.6,11.4 C40.2 26.16,11.71 U1.3
  Route2 0.15: v27,19 27,11.9 v26.6,11.4
N$19
  Top 0.2: 11.6,1.2 11.6,8.8
N$31
  Top 0.15: U3.1 6.75,11.15 6.4,10.8 3.6,10.8 2.9,11.5 2.9,11.6 | 2.9,11.6 R98.2 | R97.2 1.3,11.6 2.9,11.6
N$35
  Top 0.2: U3.5 6.75,8.15 7,7.9 8.45,6.76 R100.1
N$37
  Top 0.15: R98.1 LED2-R.C
N$42  (via drill 0.4 pad 0.7)
  other vias: 34.51,53.4
NRST  (via drill 0.4 pad 0.7)
  Top 0.15: IC3.4 21.2,34.7 20.6,35.3 13.6,35.3 13.6,33.6 14,33.2 14,32.45 C20.1 14.05,31.65 v14,31.6
  Top 1: v14,31.6 14.02,31.6
P0.00/XL1  (via drill 0.3 pad 0.7 layers 1-2)
  Top 0.15: C41.1 14,10.25 SW1.2 13.9,6.6 16.15,6.6 | 16.15,6.6 S1.1 16.3,9.02 v16.3,10.1 | 16.15,6.6 S1.2 | IC4.P$2 26.45,22.95 27.6,21.8 27.6,20.5 27.3,20.2 25,20.2 23.9,19.1 23.9,16.92 23.56,16.58 23.56,11.48 v22.9,10.6
  Route2 0.15: v22.9,10.6 18.7,10.6 18.1,11.2 17.4,11.2 v16.3,10.1
P0.01/XL2
  Top 0.15: S2.2 21.85,6.2 | 21.85,6.2 S2.1 | C42.1 23.9,10.4 | 23.9,10.4 24,8.9 24.1,8.9 SW2.2 24,6.8 23.4,6.2 21.85,6.2 | 23.9,10.4 23.9,16.3 24.3,16.7 24.3,19 25.1,19.8 27.4,19.8 28,20.4 28,22 26.55,23.45 IC4.P$3
P0.04  (via drill 0.3 pad 0.7)
  Top 0.15: IC4.P$4 27.45,23.95 v27.9,23.5 | v16.3,17.4 15.7,17.4 15.6,17.3 R90.1
  Bottom 0.15: v27.9,23.5 26.4,23.5 24.4,21.6 20.4,21.6 v16.3,17.4
P0.12
  Top 0.125: IC4.P$10 22.45,27.65 22.5,27.8 24.8,28.8 25.6,28.8 25.6,27.3 27.25,27.3 R84.2
P0.25
  Top 0.15: IC4.P$26 19.95,20.65 21,19.6 21,16.4 19.4,14.8 R92.2
P0.28
  Top 0.15: IC4.P$27 20.45,20.95 21.4,19.8 21.4,15.4 20.7,14.7 R93.2
P0.30
  Top 0.15: IC4.P$28 20.95,21.05 21.8,20 21.8,15.2 22.1,14.7 R94.2
PA0  (via drill 0.3 pad 0.7 layers 1-2)
  Top 0.15: v27.5,31.8 27.5,32.55 R83.2 | IC3.6 20.2,32.7 20.7,32.1 v20.7,32
  Route2 0.15: v20.7,32 20.7,32.6 20.9,32.8 23.2,32.8 23.6,32.4 26.9,32.4 v27.5,31.8
PA2  (via drill 0.3 pad 0.7 layers 1-2)
  Top 0.15: R81.2 12.3,34.5 | 12.3,34.5 R82.1 | IC3.8 18.7,33 18.6,33.1 v17.1,33.1 16.65,33.55 C19.1 | v11.1,33.1 11.5,33.1 12.3,33.9 12.3,34.5
  Route2 0.15: v17.1,33.1 16.8,33.2 16.6,33.4 11.5,33.4 v11.1,33.1
PA3  (via drill 0.3 pad 0.7 layers 1-2)
  Top 0.125: v27.4,30.1 28.1,29.6 28.1,28.4 28.2,28.3 29.7,28.3 30,28 30,27.7
  Top 0.15: IC3.9 19.8,32.5 20,32.3 20,31.7 20.3,31.4 21.5,31.4 21.7,31.6 v21.7,32 | 30,27.7 30,21.4 v29.3,20.7 | v29.6,6.1 30,6.5 30,7.7 U4.4
  Top 0.5: U4.4 30.05,6.5 R101.2
  Route2 0.15: v21.7,32 21.9,31.8 25.7,31.8 v27.4,30.1 | v29.3,20.7 29.3,6.4 v29.6,6.1
PA10  (via drill 0.3 pad 0.7)
  Top 0.15: IC3.20 22.2,28.7 v21.9,28.4 | v28.6,19.9 28.85,19.55 R85.1
  Bottom 0.15: v21.9,28.4 22.2,28.1 23.2,28.1 23.3,28.2 24,28.2 24.1,28.1 27,28.1 29.5,25.6 29.5,23.1 28.4,22 28.4,20.1 v28.6,19.9
PA15  (via drill 0.3 pad 0.7 layers 1-2)
  Top 0.125: IC3.23 25.8,30.5 26.4,31 29.1,31 v29.3,30.8 | 34,2.9 33.95,2.85 33.9,2.8
  Top 0.15: R103.1 35.7,2.85 33.95,2.85 Q1.1
  Top 0.3: v37.2,2.9 34,2.9
  Route2 0.125: v29.3,30.8 30.7,29.5 30.7,15 36.7,15 37.7,14 37.7,3.4 v37.2,2.9
PB0  (via drill 0.3 pad 0.7)
  Top 0.15: IC3.14 18.1,30 16.5,28.9 v16.5,27.4 | 14.1,17.3 R89.1 v14.1,17.6
  Bottom 0.15: v16.5,27.4 16.5,20.6 14.1,18.2 v14.1,17.6
PB1  (via drill 0.3 pad 0.7)
  Top 0.15: U1.6 24.84,15.64 24.7,15.9 v24.6,15.9 | IC3.15 19.7,29.5 19.5,29.3 18.2,29.3 17.2,28.6 17.2,26.7 v17.3,26.6
  Bottom 0.15: v17.3,26.6 23.8,26.6 26.1,24.3 28.3,24.3 28.8,23.8 28.8,23 27.6,21.8 27.6,20.8 26.7,19.9 25.7,19.9 24.6,18.8 v24.6,15.9
RF
  Top 0.3: L1.2 13.5,27.6 U$1.P$1
S1  (via drill 0.4 pad 0.7, 0.4 pad 0.7 layers 15-16)
  Top 0.15: v6,69 5.5,68.5
  Top 0.2: R25.2 C1.2 3.3,64.3 R17.1 R9.1 R1.1 3.35,67.95 3.8,68.4 5.4,68.4 5.5,68.5
  Route15 0.15: v16.4,67 17.8,65.6 17.8,63.4 17.7,63.3 17.7,62.3 17.8,62.2 v17.8,61
  Bottom 0.125: 4.84,68.08 5.92,67 v16.4,67
  Bottom 0.15: 23.72,63.36 18.36,63.36 17.8,62.8 17.8,61.03 | 17.8,61.03 17.83,61 | v17.8,61 17.8,61.03 | 4.84,68.08 5.08,68.08 v6,69
  Bottom 0.2: 4.84,68.08 4.84,68.36
  Bottom 1.5: 4.84,68.08 4.85,68.08 | 17.82,61 17.83,61 | 23.72,63.36 23.73,63.36
S2  (via drill 0.4 pad 0.7, 0.4 pad 0.7 layers 15-16)
  Top 0.15: 7.59,67 R10.1 | 7.55,65.6 R18.1 | R2.1 7.55,67.15 8.33,67.93 v8.33,69.03
  Top 0.2: R2.1 7.59,67 | R10.1 7.55,65.6 | R18.1 7.44,64.2 C2.2 R26.2 9,62.95
  Route15 0.15: v20.18,61.01 20.78,61.58 v20.8,65.8 20.8,69.8 v20.79,69.66
  Bottom 0.125: 6.36,70.44 7,69.4 v8.33,69.03 8.83,69.03 9.2,69.4 13,69.4 13.6,68.8 14.2,68.8 14.75,69.22 20.33,69.2 v20.79,69.66
  Bottom 0.15: 24.9,65.72 24.82,65.8 v20.8,65.8 | v20.18,61 v20.18,61.01 | 6.02,70.44 6.36,70.44
  Bottom 1.5: 6.02,70.44 6.01,70.44 | v20.18,61 v20.19,61 | 24.9,65.72 24.91,65.72
S3  (via drill 0.4 pad 0.7, 0.4 pad 0.7 layers 15-16)
  Top 0.15: R19.1 R11.1 R3.1 12.65,68 13.8,68 15,69.2 17.6,69.2 18.6,68 v18.6,66.4
  Top 0.2: R19.1 11.6,64.2 C3.2 R27.2
  Route15 0.15: v18.6,66.4 v18.61,66.39 18.61,66.01 18.4,65.8 18.39,64.86 19,64.2 19,63.3 19.1,63.2 19.1,62.5 19,62.4 v19.01,58.64
  Bottom 0.125: 6.03,65.72 7.02,66.71 15.28,66.71 15.79,66.2 | 26.08,68.08 21.08,68.08 19.4,66.4
  Bottom 0.15: 15.79,66.2 18.4,66.2 v18.6,66.4 19.4,66.4
  Bottom 0.2: 6.03,65.72 6,65.75
  Bottom 1.5: 6.02,65.72 6.03,65.72 | 26.08,68.08 26.09,68.08 | v19,58.64 v19.01,58.64
S4  (via drill 0.4 pad 0.7 layers 1-2, 0.4 pad 0.7 layers 15-16, 0.4 pad 0.7 layers 2-15)
  Top 0.15: v16.8,68.4 16.78,68.38 16.58,68.38 16,67.8 16,66.99 R8.1
  Top 0.2: R8.1 15.99,66.96 R16.1 16.01,65.48 R20.1 C4.2 R28.2
  Route2 0.15: v16.8,68.4 18.2,68.8 v19.13,68.8
  Route15 0.125: 19.02,67.38 20,66.4 20,64.67
  Route15 0.15: v19.13,68.8 19.13,69.98 18.96,70.15 v18.96,71 17.82,72.6 8.4,72.6 7.2,71.4 v7.2,68.08 | v19.13,68.8 | v19.13,68.8 19.02,67.38 | 20,64.67 19.45,64.18 19.47,59.92 v20.89,58.95 | v19.13,68.8 | v19.13,68.8
  Bottom 0.125: 26.19,71.42 19.35,71.42 v18.96,71
  Bottom 0.15: 27.26,70.44 26.19,71.42 | v20.89,58.95 20.96,58.64 21.37,58.64
  Bottom 0.2: 21.36,58.64 20.96,58.64 20.76,58.64
  Bottom 1.5: v7.2,68.08 v7.21,68.08 | 27.26,70.44 27.33,70.44 | 21.36,58.64 21.37,58.64
S5  (via drill 0.4 pad 0.7, 0.4 pad 0.7 layers 15-16)
  Top 0.15: v25.2,70.8 24.8,70.8 22,68 21.35,68 R4.1
  Top 0.2: R4.1 R12.1 R21.1 20.2,64.2 C5.2 R29.2
  Route15 0.15: v25.2,70.8 25.44,70.56 25.44,64.41 v26.29,63.16 | v8.04,70.48 8.04,69.84 7.6,69.4 7.6,68.72 7.99,68.33 8,63.5 8.1,63.4 8.1,63 8.04,62.94 8.04,61.34 v8.38,61
  Bottom 0.125: v25.2,70.8 22,70.8 21.65,71.04 20.05,71.04 19.33,70.31 18.53,70.31 18.22,70.7 12.3,70.7 11.5,71.6 9.64,71.6 8.48,70.44
  Bottom 0.15: 8.38,70.44 8.38,70.78 | 8.48,70.44 8.38,70.44 | v8.04,70.48 8.33,70.44 8.38,70.44 | v26.29,63.16 26.09,63.36
  Bottom 1.5: 8.38,70.44 8.37,70.44 | v8.38,61 v8.39,61 | 26.08,63.36 26.09,63.36
S6  (via drill 0.4 pad 0.7, 0.4 pad 0.7 layers 15-16)
  Top 0.15: v27.2,66 27.2,68 26.8,68.4 24.8,68.4 24.35,67.95 R5.1 | R13.1 24.35,66.28 23.4,66.28 v23.2,66.6
  Top 0.2: R5.1 24.35,66.28 R13.1 R22.1 24.2,64.2 C6.2 R30.2
  Route15 0.15: v23.2,66.6 24,65.8 24,62.2 23.6,61.8 23.6,58.6 v23.69,58.73
  Bottom 0.125: 4.84,63.64 5.8,64.6 11.4,64.6 11.6,64.4 14.4,64.4 15.4,65.4 19.4,65.4 20.6,66.6 v23.2,66.6
  Bottom 0.15: 23.72,58.64 23.73,58.58 v23.69,58.73 | 4.84,63.36 4.84,63.64 | v27.2,66 27.2,65.78 27.26,65.72
  Bottom 1.5: 4.84,63.36 | 27.26,65.72 | 23.72,58.64
S7  (via drill 0.4 pad 0.7, 0.4 pad 0.7 layers 15-16)
  Top 0.15: R31.2 30.85,62.85 v31.4,63.4
  Top 0.2: R6.1 28.49,67 R14.1 R23.1 28.4,64.2 C7.2 R31.2
  Route15 0.15: v21.6,68.8 22.27,68.33 22.2,62.6 22.47,62.33 v22.47,61.03
  Bottom 0.125: 9.56,68.08 10.58,69.1 12.7,69.1 13.4,68.4 14.4,68.4 15,68.76 17,68.76 17.2,68.8 v21.6,68.8
  Bottom 0.15: 22.54,61 22.92,61.38 | 22.92,61.38 23.74,62.2 29.65,62.2 30.81,63.36 30.85,63.4 v31.4,63.4 | 22.92,61.38 v22.47,61.03
  Bottom 1.5: 9.56,68.08 9.57,68.08 | 30.8,63.36 30.81,63.36 | 22.54,61 22.55,61
S8  (via drill 0.4 pad 0.7, 0.4 pad 0.7 layers 15-16)
  Top 0.15: R7.1 32.75,69.25 30.2,69.25 v29.6,71.9
  Top 0.2: R32.2 C8.2 32.6,64.2 R24.1 R15.1 R7.1
  Route15 0.15: 13,61.11 v13.11,61 13.1,61.68 13,61.8 13,70 13.11,70.11 v13.11,71.42 10.42,71.42 10,71 10,68.6 9.2,67.8 v9.2,66
  Bottom 0.15: 29.57,70.44 29.57,71.43 | 29.57,71.43 29.19,72.19 29.07,72.4 27.2,72.4 27,72.2 13.8,72.17 v13.11,71.42 | 8.38,65.72 8.92,65.72 v9.2,66 | v29.6,71.9 29.64,71.8 29.57,71.43
  Bottom 1.5: 8.38,65.72 8.39,65.72 | v13.1,61 v13.11,61 | 29.62,70.44 29.57,70.44
S9  (via drill 0.4 pad 0.7, 0.4 pad 0.7 layers 1-2, 0.4 pad 0.7 layers 15-16)
  Top 0.15: R41.1 3.55,57.75 4,58.2 v5.4,58.2
  Top 0.2: R41.1 R49.1 R57.1 3.55,51.9 C9.2 R65.2
  Route2 0.15: v5.4,58.2 5.6,58.4 5.6,60 5.2,60.4 5.2,61.6 6.2,62.6 6.2,64.8 6.6,65.4 6.6,67 6.2,67.4 6.2,68.2 7,69 8.41,69 9.86,70.45 v10.73,70.45 v10.74,70.44
  Route15 0.15: v10.74,70.44 v10.74,61.01 | v28.4,69.66 v28.4,63.4
  Bottom 0.125: v28.4,69.66 28,69.4 26.72,69.39 25.92,69.79 24.2,69.8 23.56,70.44 21.76,70.44 21.42,70.67 20.22,70.67 19.6,70 15.6,70
  Bottom 0.15: v10.74,61.01 v10.75,61 | v28.4,63.4 v28.4,63.41 28.45,63.36 | 10.78,70.4 v10.74,70.44 10.8,70.5 10.8,70.6 11.2,70.3 15.3,70.3 15.6,70
  Bottom 1.5: v10.74,70.44 v10.73,70.44 | v10.74,61 v10.75,61 | 28.44,63.36 28.45,63.36
S10  (via drill 0.4 pad 0.7 layers 1-2, 0.4 pad 0.7 layers 15-16, 0.4 pad 0.7 layers 2-15)
  Top 0.15: R42.1 8.55,57.95 v9.4,58.8
  Top 0.2: R42.1 R50.1 R58.1 8.4,53.45 C10.2 R66.2
  Route2 0.15: v9.4,58.8 8.8,58.8 v8.4,59.2
  Route15 0.15: v15.47,61 15.47,61.73 15.2,62 15.2,64.28 15.47,64.55 15.47,66.13 14.64,66.87 14.64,70.67 v15.6,71.4 | v28.37,71.73 28.77,71.7 30,70.4 30,68.2 29.6,67.8 v29.6,65.8 | v8.4,59.2 8.6,59.2 7.6,60.4 7.6,62.8 v7.4,63.2
  Bottom 0.125: 8.38,62.2 13,62.2 13,62.21 13.66,61.96 v15.46,61 | 18.2,71.4 18.6,71.8 28.2,71.8
  Bottom 0.15: 7.2,63.36 7.48,63.08 | 7.48,63.08 8.38,62.2 | v15.6,71.4 18.2,71.4 | 28.2,71.8 v28.37,71.73 | v29.6,65.8 29.62,66.18 29.62,65.72 | v7.4,63.2 7.4,63 7.48,63.08
  Bottom 1.5: 7.2,63.36 7.21,63.36 | v15.46,61 v15.47,61 | 29.62,65.72 29.63,65.72
S11  (via drill 0.4 pad 0.7 layers 1-2, 0.4 pad 0.7 layers 15-16, 0.4 pad 0.7 layers 2-15)
  Top 0.15: R43.1 13.4,57.65 v13.4,58
  Top 0.2: R43.1 R51.1 R59.1 12.35,52 C11.2 R67.2
  Route2 0.15: v13.4,58 13.4,58.8 13.8,59.2 13.8,59.5 13.39,59.91 12.3,59.91 v11.9,60.31
  Route15 0.15: v27.26,61 27.26,61.86 27.6,62.2 27.6,64.15 27.88,64.43 27.88,66.34 27.26,66.96 v27.27,67.34 | v11.9,60.31 11.9,65.7 v11.6,66
  Bottom 0.125: 11.13,65.33 12.11,64.75 14.15,64.75 15.2,65.8 19.25,65.78 20.85,67.38 23.8,67.4 24.29,67.01 26.9,67.02 v27.27,67.34 27.67,67 29.6,67 30.68,68.08
  Bottom 0.15: 10.74,65.72 11.13,65.33 11.6,65.8 v11.6,66 | 30.8,68.08 30.68,68.08
  Bottom 1.5: 10.74,65.72 10.75,65.72 | v27.26,61 v27.27,61 | 30.8,68.08 30.81,68.08
S12  (via drill 0.4 pad 0.7 layers 1-2, 0.4 pad 0.7 layers 15-16, 0.4 pad 0.7 layers 2-15)
  Top 0.15: R44.1 16.35,56.75 17.8,58.2 v17.8,59
  Top 0.2: R44.1 R52.1 R60.1 16.35,52 C12.2 R68.2
  Route2 0.15: v17.8,59 18.8,60 v24.8,60
  Route15 0.15: v26.09,66.31 27.11,64.69 27.11,62.74 25.37,61 v24.9,61 24.8,60.9 v24.8,60 | v9.56,63.36 8.47,64.29 8.46,66.45 8.46,67.06 8.8,67.4 8.8,68.2 9.2,68.6 9.2,71.4 v8.8,71.8
  Bottom 0.125: 31.98,65.72 31,66.69 | 31,66.69 26.68,66.69 v26.09,66.31 | v8.8,71.8 9.59,72.54 26.8,72.6 26.95,72.75 30.35,72.75 30.56,72.54 31.99,72.54 33.4,71 33.4,70 32,68.6 32,67.7 31,66.69
  Bottom 1.5: v9.56,63.36 | v24.9,61 | 31.98,65.72
S13  (via drill 0.4 pad 0.7 layers 1-2, 0.4 pad 0.7 layers 15-16, 0.4 pad 0.7 layers 2-15)
  Top 0.15: R45.1 20.15,56.75 21,57.6 21.4,57.6 v22,58.2
  Top 0.2: R45.1 R53.1 R61.1 20,53.25 C13.2 R69.2
  Route2 0.15: v22,58.2 21,58.2 20.6,58.6 19.88,58.6 19.27,57.99 15.99,57.99 15.6,57.6 14.8,57.6 14.4,58 14.4,60.28 v14.48,60.4
  Route15 0.15: v13.8,69.6 v13.8,65.6 14.48,65.12 v14.48,60.4 14.48,58.68 14.4,58.6 v14.28,58.59
  Bottom 0.125: 31.98,70.44 30.79,69.3 29.15,69.35 28.7,69.05 27.87,69.03 27.79,69.07 26.63,69.07 25.8,69.4 24,69.4 23.6,69.8 21.8,69.8 21.21,70.3 20.41,70.3 19.8,69.6 14.2,69.61
  Bottom 0.15: 13.1,65.72 13.68,65.72 v13.8,65.6 | v14.28,58.59 14.28,58.64 | 14.2,69.61 14,69.6 v13.8,69.6
  Bottom 1.5: 13.1,65.72 13.11,65.72 | 31.98,70.44 32.01,70.44 | 14.28,58.64 14.29,58.64
S14  (via drill 0.4 pad 0.7 layers 1-2, 0.4 pad 0.7 layers 15-16, 0.4 pad 0.7 layers 2-15)
  Top 0.15: 25.85,58.2 v26,58.2 25,58.2 24.35,57.55 R46.1
  Top 0.2: R70.2 C14.2 24.2,53.25 R62.1 R54.1 R46.1
  Route2 0.15: v26,58.2 26.2,58.2 v28.6,60.6
  Route15 0.15: v29.59,64.12 29.58,61.82 v29.6,61 29,61 v28.6,60.6
  Bottom 0.125: 12.64,63.36 13.85,62.31 14.83,62.3 16.71,64.31 23.2,64.3 23.3,64.4 24.2,64.4 24.29,64.31 25.65,64.31 25.7,64.36 26.34,64.36 26.4,64.3 27.8,64.3 27.84,64.34 28.8,64.34 28.83,64.31 29.22,64.31 v29.59,64.12
  Bottom 0.15: 33.16,68.08 33.16,65.04 34.4,63.8 34.4,62.8 33.8,62.2 30.82,62.2 29.62,61 29.6,61.02 v29.6,61 | 11.92,63.36 12.64,63.36
  Bottom 1.5: 11.92,63.36 | 29.62,61 | 33.16,68.08
S15  (via drill 0.4 pad 0.7 layers 1-2, 0.4 pad 0.7 layers 15-16, 0.4 pad 0.7 layers 2-15)
  Top 0.15: R47.1 28.35,57.75 29.22,58.62 v29.72,58.62
  Top 0.2: R47.1 R55.1 R63.1 28.35,52 C15.2 R71.2
  Route2 0.15: v29.72,58.62 31,59.9 31,62.4 30.5,62.8 30.53,63.52 31.2,64.6 31.17,65.73 30.38,66.29 30.4,68.6 v28.38,70.71
  Route15 0.15: v15.4,68.1 15.4,67 16.7,65.7 v16.68,58.67 | v27.6,68.4 27.4,68.4 26.2,69.6 26.2,71 25.6,71.6 21,71.6 20,70.6 20,68 v19.8,67.8 | v28.38,70.71 29.11,69.89 v29.14,68.39
  Bottom 0.15: 12.4,67.6 15,67.6 v15.4,68.1 15.6,67.8 v19.8,67.8 | v16.68,58.67 16.7,58.69 arc-90 16.65,58.64 | 28.44,68.08 27.92,68.08 v27.6,68.4 | v29.14,68.39 28.52,68.1 28.46,68.1
  Bottom 0.2: 11.92,68.08 12.4,67.6 | 28.44,68.08 28.46,68.1
  Bottom 1.5: 11.92,68.08 11.93,68.08 | 28.44,68.08 28.45,68.08 | 16.64,58.64 16.65,58.64
S16  (via drill 0.4 pad 0.7, 0.4 pad 0.7 layers 15-16)
  Top 0.15: v34.4,57.8 33.2,57.8 32.8,57.4 32.8,56.45 R48.1
  Top 0.2: R72.2 C16.2 32.75,52 R64.1 R56.1 R48.1
  Route15 0.15: v33.16,63.36 33.44,63.36 34.4,62.4 34.4,61.4 34,61 34,58.4 34.4,58 v34.4,57.8
  Bottom 0.125: 14.28,63.36 15.58,64.69 29.2,64.74 29.22,64.75 30.08,64.75 30.11,64.73 31.72,64.73 33.04,63.36
  Bottom 0.15: 14.28,63.36 14.28,63.68 | v33.16,63.36 33.04,63.36
  Bottom 1.5: 14.28,63.36 | v33.16,63.36
S21  (via drill 0.4 pad 0.7 layers 1-2, 0.4 pad 0.7 layers 15-16, 0.4 pad 0.7 layers 2-15)
  Top 0.15: R1.2 5.2,67 v5.4,66.8
  Route2 0.15: v5.4,66.8 4.8,66.8 4,66.2 4,62 v3.6,61.2
  Route4 0.125: 24,40.7 19.1,40.7 18.4,41.2 15.4,41.2 14.8,40.6 12.4,40.6 7.4,45.7 7.4,47.6 6.2,48.8 6.2,51.2 4.8,52.6
  Route4 0.15: v23.9,56.52 23.9,56.12 24.06,55.97 25.8,56 26.2,55.6 28.2,55.6 28.4,55.8 30,55.8 30.8,55 30.8,52.2 31.6,51.4 33.6,51.4 34.8,50.2 34.8,49.5 33.8,48.4 31.8,46.4 31.8,43.9 29,40.8 24,40.7 | 4.8,52.6 4.8,53.4 3.4,54.8 3.4,59 v3.6,59.2
  Route15 0.15: v3.6,61.2 v3.6,59.2 v4.8,59.2 | v24.9,56.28 24.64,56.54 v23.9,56.52
  Bottom 0.15: v4.8,59.2 4.8,58.68 4.84,58.64 4.84,55.86 5.88,54.9 13.14,54.9 14.14,53.92 14.28,53.92
  Bottom 1.5: 4.84,58.64 | v24.9,56.28 | 14.28,53.92
S22  (via drill 0.4 pad 0.7, 0.4 pad 0.7 layers 1-2, 0.4 pad 0.7 layers 15-16)
  Top 0.15: R2.2 9.6,67 v10,67.4
  Route2 0.15: v10,67.4 9,67.4 6.6,64.6 6.6,62 6.04,61.44 v6.04,61.03
  Route15 0.15: v15.46,56.28 15.43,56.31 v15.42,59.5
  Bottom 0.125: 15.43,59.66 24.95,59.66 26.08,58.64
  Bottom 0.15: 6.02,61 6.2,61 | 6.2,61 6.8,61 8,59.8 15,59.8 15.14,59.66 15.43,59.66 15.4,59.29 v15.42,59.5 | v6.04,61.03 6.4,61.2 6.2,61
  Bottom 1.5: 6.02,61 | 26.08,58.64 | v15.46,56.28
S23  (via drill 0.4 pad 0.7 layers 1-2, 0.4 pad 0.7 layers 15-16, 0.4 pad 0.7 layers 2-15)
  Top 0.15: R3.2 v13.6,67
  Route2 0.15: v13.6,67 16,64.6 v16,63.8
  Route15 0.15: v6.02,56.28 7.05,57.31 10.95,57.3 11.12,57.47 12.32,57.47 12.48,57.31 13.39,57.31 14.06,56.64 14.06,55.95 15.46,54.55 v15.46,51.69 15.66,51.86 17.4,53 17.4,56.2 15.88,57.78 15.89,58.85 16.2,59.2 16.2,62.2 v16,62.4 v16,63.8
  Bottom 0.125: 28.44,58.64 27.02,60 17.12,60 16.59,60.49 16.59,61.71 v16,62.4
  Bottom 0.15: v15.46,51.69 15.46,52.09 15.46,51.56
  Bottom 1.5: v6.02,56.28 | 28.44,58.64 | 15.46,51.56
S24  (via drill 0.4 pad 0.7, 0.4 pad 0.7 layers 15-16, 0.4 pad 0.7 layers 2-15)
  Top 0.15: R8.2 17.76,66.96 v17.6,67
  Route3 0.15: v17.6,67 17.4,67 16.6,66.2 13.4,66.2 7.8,60.2 v7.2,59.6
  Route15 0.15: v16.6,54 15.8,55.4 15.2,55.4 14.6,56 14.6,57.2 13.4,58 8.2,58 7.76,58.64 v7.21,58.64 v7.2,58.65 v7.2,59.6
  Bottom 0.125: 26.08,54.32 25.2,55.2 19.8,55.2 19.62,55.36 18.68,55.37 18.45,55.37 18.44,55.36 16.77,54.03
  Bottom 0.15: 26.08,53.92 26.08,54.32 | 16.65,53.92 16.77,54.03 v16.6,54
  Bottom 1.5: v7.2,58.64 v7.21,58.64 | 26.08,53.92 26.09,53.92 | 16.64,53.92 16.65,53.92
S25  (via drill 0.4 pad 0.7 layers 1-2, 0.4 pad 0.7 layers 15-16, 0.4 pad 0.7 layers 2-15)
  Top 0.15: R4.2 21.85,67.2 v22,67.2
  Route2 0.15: v22,67.2 23.2,68.4 26.8,68.4 28.8,66.4 28.8,61.8 26,59 25.8,59 25.2,58.4 25.2,57.8 25.6,57.4 26.7,57.41 27.1,57.01 27.09,56.59 26.9,56.4 v26.77,56.33
  Route15 0.15: v27.3,48.33 27.3,50.3 28.4,51.4 28.4,52.6 v27.24,54.84 | v27.7,56.33 v26.77,56.33 | v7.8,50.38 5.8,50.4 5.2,51 5.2,52.4 v5.8,53
  Bottom 0.125: 17.2,49.2 18.2,48.17 26.97,48.17 v27.3,48.33 | 16.64,49.01 15.77,48.16 9.04,48.16 8.38,48.83 8.38,49.82 v7.8,50.38
  Bottom 0.15: 17.2,49.2 16.64,49.2 16.64,49.01 | v27.24,54.84 27.24,56.38 | 27.24,56.38 27.26,56.28 | 27.24,56.38 27.67,56.38 v27.7,56.33 | v5.8,53 5.8,53.6 5.48,53.92 4.84,53.92
  Bottom 1.5: 27.26,56.28 | 4.84,53.92 | 16.64,49.2
S26  (via drill 0.4 pad 0.7 layers 1-2, 0.4 pad 0.7 layers 15-16, 0.4 pad 0.7 layers 2-15)
  Top 0.15: 25.65,67.05 R5.2 25.8,67 v26.12,67.37
  Route2 0.15: v26.12,67.37 24.8,67.4 v24.6,67
  Route3 0.15: v24.6,67 24.6,66 24.4,65.8 24.4,62.8 25.8,61.4 25.8,59.6 25,58.8 25,52.6 v25.6,52
  Route4 0.15: v25.6,52 24,52 23.6,52.4 9.8,52.4 9,53.1 9,55.6 v9.2,55.8
  Route15 0.15: v27.26,51.56 26.04,51.56 v25.6,52 | v9.2,55.8 8.92,56.35 v8.38,56.36
  Bottom 0.15: 17.82,56.28 16.56,55.23 11.95,55.24 11.89,55.2 11.1,55.2 11.05,55.23 9.82,55.23 8.52,56.28 8.38,56.28 8.26,56.4 v8.38,56.36
  Bottom 1.5: 8.38,56.28 | 17.82,56.28 | v27.26,51.56
S27  (via drill 0.4 pad 0.7 layers 1-2, 0.4 pad 0.7 layers 15-16, 0.4 pad 0.7 layers 2-15)
  Top 0.15: R6.2 30.8,67 v31.2,66.6
  Route2 0.15: v31.2,66.6 31.6,66.2 31.6,64.6 32.4,63.8 32.4,63 31.49,61.87 31.49,58.27 29.2,56.4 29,56.4 28.91,56.31 v28.91,55.03
  Route15 0.15: v17.82,51.56 17.82,54.62 19,55.8 v19,57 | v28.91,55.03 v28.9,55.02 v28.79,53.97
  Bottom 0.125: 11.45,57.35 19,57.34 | 19,57.34 19.58,57.34 19.66,57.26 20.5,57.26 20.59,57.31 27.85,57.3 28.4,56.8 28.4,54 | v19,57 19,57.34
  Bottom 0.15: 9.56,58.64 10.12,58.65 11.45,57.35 | 28.44,53.92 28.4,53.96 28.4,54 28.73,54 v28.79,53.97
  Bottom 1.5: 9.56,58.64 | 28.44,53.92 | v17.82,51.56
S28  (via drill 0.4 pad 0.7 layers 1-2, 0.4 pad 0.7 layers 15-16, 0.4 pad 0.7 layers 2-15)
  Top 0.15: R7.2 v33.4,68.2
  Route2 0.15: v33.4,68.2 33.4,59.6 33,59.2 33,55 32.4,54.4 32.4,53.4 v31.8,52.8
  Route15 0.15: v31.8,52.8 31,52.8 v29.8,51.8
  Bottom 0.125: 6.8,52.6 17.69,52.6 19.01,53.92 | 19,53.92 20.41,52.59 28.48,52.59 29.43,51.56
  Bottom 0.15: 6.03,51.56 6.03,51.83 6.8,52.6 | 29.43,51.56 29.62,51.56 29.8,51.74 v29.8,51.8
  Bottom 1.5: 19,53.92 19.01,53.92 | 6.02,51.56 6.03,51.56 | 29.62,51.56 29.63,51.56
S29  (via drill 0.4 pad 0.7, 0.4 pad 0.7 layers 1-2)
  Top 0.15: R41.2 v5.4,56.8
  Route2 0.15: v5.4,56.8 6.2,56.8 7.52,54.88 v7.52,54.1
  Bottom 0.125: 7.68,53.92 8.65,52.9 17.16,52.9 17.8,53.6 17.79,54.27 18.57,55 19.45,55 19.56,54.89 20.41,54.89 21.36,53.92 | 21.36,53.92 22.5,52.9 29.02,52.9 29.62,53.42 29.62,56.28
  Bottom 0.15: 7.2,53.92 7.4,53.92 | 7.4,53.92 7.68,53.92 | v7.52,54.1 7.4,54.18 7.4,53.92
  Bottom 1.5: 29.62,56.28 | 21.36,53.92 | 7.2,53.92
S31  (via drill 0.4 pad 0.7 layers 1-2, 0.4 pad 0.7 layers 15-16, 0.4 pad 0.7 layers 2-15)
  Top 0.15: R9.2 v5.6,65.6
  Route2 0.15: v5.6,65.6 4.8,65.6 4.4,65 4.4,58.8 2.8,56.8 2.8,54.6 3.13,54.06 3.13,49.53 v3.3,49.2
  Route15 0.15: v3.3,49.2 v7,49.2
  Bottom 0.125: 7.6,49.2 8.76,47.82 18.98,47.82 20.18,46.84
  Bottom 0.15: 7.21,49.2 7.6,49.2 | v7,49.2 7.2,49.2
  Bottom 1.5: 7.2,49.2 7.21,49.2 | 20.18,46.84 20.19,46.84
S32  (via drill 0.4 pad 0.7 layers 1-2, 0.4 pad 0.7 layers 15-16, 0.4 pad 0.7 layers 2-15)
  Top 0.15: R10.2 9.2,65.6 v9.6,65.2
  Route2 0.15: v9.6,65.2 7.8,65.2 7,64.4 7,60.8 6.2,60 6.2,57.8 5.79,57.51 4.99,57.51 3.6,56 3.6,55 3.98,54.4 3.99,53.61 4,53 4,52.6 4.4,52.2 4.4,47.8 v5.8,46.4
  Route15 0.15: v24.95,45.34 24.95,48.06 v23.74,49.18 | v5.8,46.4 5.8,45.8 7,44.8 v9.56,44.8
  Bottom 0.125: 9.56,44.48 10.51,45.48 24.43,45.48 v24.95,45.34
  Bottom 0.15: v23.74,49.18 24.12,48.8 23.72,49.2 | v9.56,44.8 9.44,44.8 9.56,44.48
  Bottom 1.5: 9.56,44.48 | 23.72,49.2
S33  (via drill 0.4 pad 0.7 layers 1-2, 0.4 pad 0.7 layers 15-16, 0.4 pad 0.7 layers 2-15)
  Top 0.15: R11.2 v12.6,65.6
  Route2 0.15: v12.6,65.6 11.8,65.6 11,64.8 11,62.4 10,61.4 10,60.6 10.6,60 10.6,58 8.4,56.8 8.4,55.4 8.8,54.8 8.8,48.23 9.56,47.47 9.56,46.04 v9.6,46
  Route15 0.15: v9.6,46 v9.6,49
  Bottom 0.125: 11.2,50.2 23.54,50.2 24.9,51.56
  Bottom 0.15: 11.2,50.2 10.2,49.2 9.56,49.2 9.6,49.56 v9.6,49
  Bottom 1.5: 9.56,49.2 | 24.9,51.56
S34  (via drill 0.4 pad 0.7 layers 1-2, 0.4 pad 0.7 layers 15-16, 0.4 pad 0.7 layers 2-15)
  Top 0.15: R16.2 18.12,65.48 v18,65.4
  Route2 0.15: v18,65.4 v19.2,65.2
  Route3 0.125: 8.4,51.6 8.4,56.4 10.6,58.6
  Route3 0.15: v19.2,65.2 18.8,64.8 13.8,64.8 11.6,62.4 10.6,61.4 10.6,58.6 | 8.4,51.6 13,47 v13,45.4
  Route15 0.15: v22.54,46.84 21.76,46.84 20.6,48 18.4,48 15.4,50.2 13.72,50.2 13.32,49.8 12.4,49.8 12.2,50 11.6,50 11.2,49.6 11.2,48.8 11.8,48 12.6,48 v13.03,46.94 13.03,45.43 v13,45.4
  Bottom 0.15: v13.03,46.94 13,46.95 13.11,46.84
  Bottom 1.5: 13.1,46.84 13.11,46.84 | v22.54,46.84 v22.55,46.84
S35  (via drill 0.4 pad 0.7 layers 1-2, 0.4 pad 0.7 layers 15-16, 0.4 pad 0.7 layers 2-15)
  Top 0.15: R12.2 v21.89,65.6
  Route2 0.15: v21.89,65.6 v23,65.6
  Route3 0.15: v23,65.6 23.87,64.66 23.87,59.66 24.6,58.8 24.61,56.07 23.4,55.39 23.4,51 25,49.8 v25,49.2
  Route15 0.15: v26.08,49.2 v25,49.2 24.66,49.2 23.95,49.91 23.18,49.91 22.69,49.42 22.69,48.29 22.2,47.8 21.4,47.8 20.8,48.4 18.6,48.4 15.63,50.55 14.83,50.55 13.91,51.48 13.91,51.88 13.4,52.4 12.8,52.4 10.8,50.4 9.6,50.4 8.6,49.4 8.6,47.8 8.4,47.6 v8.4,46.8
  Bottom 0.15: v8.4,46.8 8.4,46.86 8.38,46.84
  Bottom 1.5: 8.38,46.84 | v26.08,49.2
S36  (via drill 0.4 pad 0.7 layers 1-2, 0.4 pad 0.7 layers 15-16, 0.4 pad 0.7 layers 2-15)
  Top 0.15: R13.2 25.65,65.45 v25.32,65.23
  Route2 0.15: v25.32,65.23 25.4,63.6 v25.2,63.4
  Route3 0.15: v25.2,63.4 25.2,62.8 26.4,61.6 26.4,59.2 28,57.6 28,50 26.2,48.2 24.4,48.2 23.6,47.5 23.6,46.2 v22.6,45.2
  Route15 0.15: v11.92,49.2 12.21,49.44 13.5,49.4 13.94,49.84 14.59,49.84 16.6,47.86 16.6,46.8 18.12,45.48 20.89,45.48 21.32,44.87 v21.32,44.49 21.89,44.49 v22.6,45.2
  Bottom 0.15: v21.32,44.49 v21.32,44.48 21.36,44.48
  Bottom 1.5: v11.92,49.2 | 21.36,44.48
S37  (via drill 0.4 pad 0.7, 0.4 pad 0.7 layers 1-2)
  Top 0.15: v30.4,65.4 30.19,65.6 R14.2
  Route2 0.15: v26,47.4 30,47.4 30.6,48 30.6,51.2 29.2,52.6 29.2,53.8 28.2,54.8 28.2,56.4 28.8,57 28.8,58.8 29.4,59.4 29.8,59.4 30.6,60.2 30.6,61.8 30,62.4 30,63.4 30.3,64 30.4,64.6 v30.4,65.4
  Bottom 0.125: 10.76,46.84 11.8,45.83 23.86,45.83 24.9,46.84
  Bottom 0.15: 10.74,46.84 10.76,46.84 | 24.9,46.84 25.44,46.84 v26,47.4
  Bottom 1.5: 10.74,46.84 | 24.9,46.84
S38  (via drill 0.4 pad 0.7 layers 1-2, 0.4 pad 0.7 layers 15-16, 0.4 pad 0.7 layers 2-15)
  Top 0.15: R15.2 34.6,65.6 34.8,65.8 34.8,68 34,68.8 v34,69.4
  Route2 0.15: v34,69.4 34,68.8 34.1,68.7 34.1,65.3 33.8,65 33.83,58.33 33.43,57.93 33.4,54.8 33.2,53.8 33.2,52.4 | 30.46,45.62 29.51,44.68 29.51,44.31 27.4,42.2 v26.4,42.2
  Route2 0.2: 30.46,45.62 32.6,47.76 32.6,51.8 33.2,52.4
  Route15 0.125: 16.6,37.8 16.6,36.8 17.4,36 21.7,36 21.8,35.9 22.6,35.9 22.7,36 26.6,36 27.27,36.67 27.27,37.73
  Route15 0.15: v14.28,49.2 16.2,47.28 16.2,46 16,45.8 16,38.4 16.6,37.8 | 27.27,37.73 v27.27,42.13 26.47,42.13 v26.4,42.2
  Bottom 0.15: v27.27,42.13 v27.26,42.12
  Bottom 1.5: v14.28,49.2 | v27.26,42.12
S39  (via drill 0.4 pad 0.7 layers 1-2, 0.4 pad 0.7 layers 15-16, 0.4 pad 0.7 layers 2-15)
  Top 0.15: 4.6,55.2 R49.2 v4.5,55.2
  Route2 0.15: v4.5,55.2 4.5,52.8 4.8,52.4 4.8,48.6 6.6,46.8 6.6,44 10,40.6 v10,39 10,37.2 12.2,35 20.6,35 v22.2,36.6
  Route15 0.15: v23.72,44.48 23.72,41.48 24.6,40.6 24.6,38 24.33,37.73 22.61,37.73 22.2,37.32 v22.2,36.6 | v15.46,46.89 15.58,46.77 15.58,38.58 14.8,37.8 14.8,37.2 14,36.2 11.8,36.2 10,37.8 v10,39
  Bottom 0.15: v15.46,46.89 15.46,46.84
  Bottom 1.5: 15.46,46.84 | v23.72,44.48
S41  (via drill 0.4 pad 0.7, 0.4 pad 0.7 layers 1-2, 0.4 pad 0.7 layers 15-16)
  Top 0.15: R17.2 4.9,64.3 v5.2,64.6
  Route2 0.15: v5.2,64.6 4.8,63.8 4.8,58.6 3.2,56.4 3.2,54.8 3.61,54.23 3.61,52.43 4,52 4,47.4 4.8,46.4 4.8,45 7.8,41.7 v8,41
  Route15 0.15: v10.6,39.8 8.5,39.9 v8,41
  Bottom 0.15: 10.64,39.76 v10.6,39.8
  Bottom 0.3: 11.92,39.76 10.64,39.76
  Bottom 1.5: 11.92,39.76
S42  (via drill 0.4 pad 0.7 layers 1-2, 0.4 pad 0.7 layers 15-16, 0.4 pad 0.7 layers 2-15)
  Top 0.15: R18.2 v10.2,64.2
  Route2 0.15: v12.6,38.2 12.6,40.5 10.2,42.9 7.4,45.3 7.4,47.6 6.4,48.8 6.4,50.6 8.4,53.6 8.4,54.4 7.6,55.6 7.6,57 10.2,58.4 10.2,59.8 9.6,60.4 9.6,61.6 10.4,62.4 10.4,64 v10.2,64.2
  Route15 0.15: v14.6,42.6 15.2,42 15.2,39.2 14.38,38.22 14.38,37.34 13.88,36.8 13.2,36.8 12.6,37.4 v12.6,38.2
  Bottom 0.15: 15.46,42.12 15.08,42.12 v14.6,42.6
  Bottom 1.5: 15.46,42.12
S43  (via drill 0.4 pad 0.7 layers 1-2, 0.4 pad 0.7 layers 15-16, 0.4 pad 0.7 layers 2-15)
  Top 0.15: R19.2 13.6,64.2 v13.8,64
  Route2 0.15: v13.8,64 13.8,62.6 13,62.6 11.8,61.4 11.06,60.28 11.06,58.54 12.37,57.28 12.6,56.8 12.28,56.14 12.88,55.54 13.42,55.54 13.71,55.83 14.45,55.83 14.87,55.41 14.87,54.71 14.36,54.2 12.86,54.2 12.75,54.09 12.32,53.18 12.32,52.79 12.72,52.39 13.6,52.39 14.05,51.94 14.05,50.51 13.44,49.9 11.98,49.9 11.87,50.01 11.86,50 11.2,50 10.8,49.6 10.8,48.6 11.6,47.8 11.6,45.6 11,45 10.9,43.4 11.7,42.2 13.1,40.9 13.7,38.4 17.6,38.4 18,38.8 19.41,38.8 19.7,39.09 19.7,40.9 19.8,41 v19.8,43.4
  Route15 0.15: v19.8,43.4 19,43.8 v18.98,44.46
  Bottom 0.15: v18.98,44.46 19.09,44.4 19.01,44.48
  Bottom 1.5: 19,44.48 19.01,44.48
S44  (via drill 0.4 pad 0.7 layers 1-2, 0.4 pad 0.7 layers 15-16, 0.4 pad 0.7 layers 2-15)
  Top 0.15: R20.2 17.8,64.2 v18.38,63.81
  Route2 0.15: v18.38,63.81 v18.38,62.92 v18.39,62.91
  Route4 0.125: 8.4,52.4 8.4,48.31 10.54,46.17 10.54,43.26 12.7,41.2 14,41.2
  Route4 0.15: v18.39,62.91 18.21,63.09 13.69,63.09 10.6,60 10.6,58.6 8.4,57.4 8.4,52.4 | 14,41.2 v14.26,41.42
  Route15 0.15: v14.26,41.42 14.26,39.9 v14.28,39.76
  Bottom 1.5: v14.28,39.76
S45  (via drill 0.4 pad 0.7 layers 1-2, 0.4 pad 0.7 layers 15-16, 0.4 pad 0.7 layers 2-15)
  Top 0.15: R21.2 v21.94,64.2
  Route2 0.15: v21.94,64.2 v23,63.6
  Route3 0.15: v23,63.6 23,57.6 21.2,55.6 21.2,50.8 18.77,48.37 v18.77,42.8
  Route15 0.15: v17.82,42.12 18.45,42.79 v18.77,42.8
  Bottom 1.5: v17.82,42.12